# Altium project Nissan-RB25DET-ECU.PrjPcb
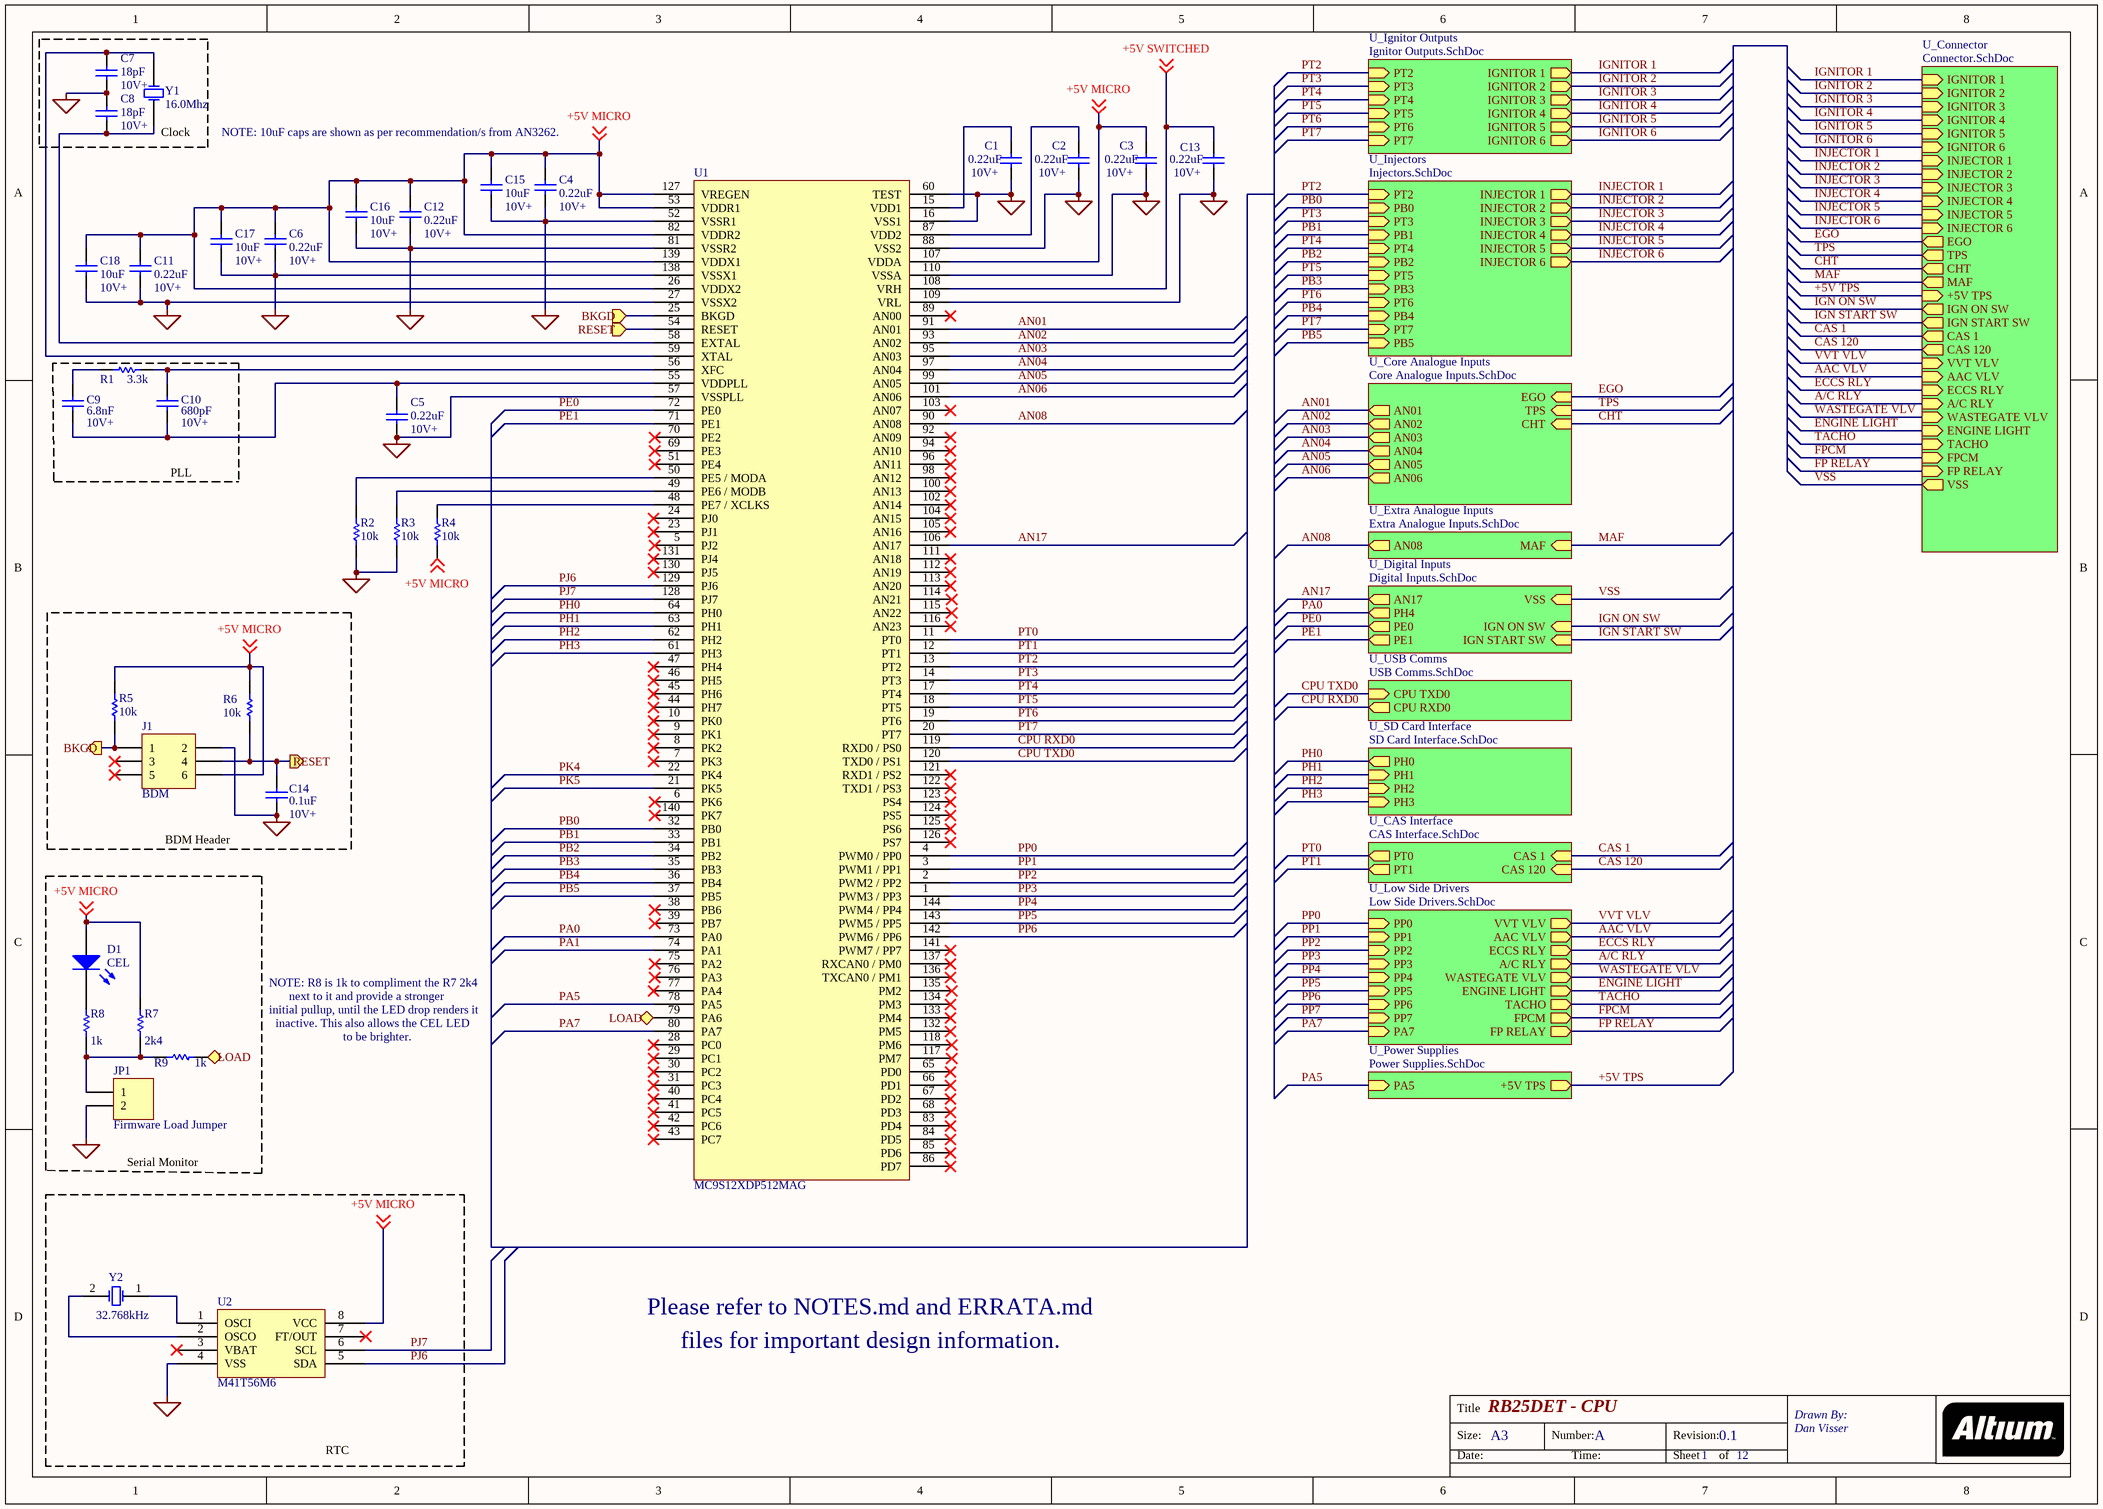
[diagram p0: CPU.SchDoc]
12 sheets, 199 parts. Net scope: hierarchical (ports join the sheet entries above them; power ports are global).
Board file: Nissan-RB25DET-ECU.PcbDoc
Sheets:
  CPU.SchDoc
    U_Ignitor Outputs = Ignitor Outputs.SchDoc
    U_Injectors = Injectors.SchDoc
    U_Digital Inputs = Digital Inputs.SchDoc
    U_USB Comms = USB Comms.SchDoc
    U_Power Supplies = Power Supplies.SchDoc
    U_CAS Interface = CAS Interface.SchDoc
    U_Connector = Connector.SchDoc
    U_Core Analogue Inputs = Core Analogue Inputs.SchDoc
    U_Extra Analogue Inputs = Extra Analogue Inputs.SchDoc
    U_Low Side Drivers = Low Side Drivers.SchDoc
    U_SD Card Interface = SD Card Interface.SchDoc

## Sheet CPU.SchDoc: RB25DET - CPU
size A3; Author: Dan Visser; CompanyName: DIYEFI; DrawnBy: Dan Visser; Engineer: Dan Visser; Address1: Drawn By:; Address2: Dan Visser; DocumentNumber: A; Revision: 0.1; SheetNumber: 1; SheetTotal: 12

### Parts
C1  value 0.22uF  [RAD-0.3]
C2  value 0.22uF  [RAD-0.3]
C3  value 0.22uF  [RAD-0.3]
C4  value 0.22uF  [RAD-0.3]
C5  value 0.22uF  [RAD-0.3]
C6  value 0.22uF  [RAD-0.3]
C7  value 18pF  [RAD-0.3]
C8  value 18pF  [RAD-0.3]
C9  value 6.8nF  [RAD-0.3]
C10  value 680pF  [RAD-0.3]
C11  value 0.22uF  [RAD-0.3]
C12  value 0.22uF  [RAD-0.3]
C13  value 0.22uF  [RAD-0.3]
C14  value 0.1uF  [RAD-0.3]
C15  value 10uF  [RAD-0.3]
C16  value 10uF  [RAD-0.3]
C17  value 10uF  [RAD-0.3]
C18  value 10uF  [RAD-0.3]
D1  CEL  [LED-0]
J1  BDM  [HDR2X3]
JP1  Firmware Load Jumper  [HDR1X2]
R1  value 3.3k  [AXIAL-0.3]
R2  value 10k  [AXIAL-0.3]
R3  value 10k  [AXIAL-0.3]
R4  value 10k  [AXIAL-0.3]
R5  value 10k  [AXIAL-0.3]
R6  value 10k  [AXIAL-0.3]
R7  value 2k4  [AXIAL-0.3]
R8  value 1k  [AXIAL-0.3]
R9  value 1k  [AXIAL-0.3]
U1  MC9S12XDP512MAG
U2  M41T56M6
Y1  16.0Mhz  [R38]
Y2  32.768kHz  [R38]

### Blocks framed on the sheet
Serial Monitor: D1 JP1 R7-R9
RTC: U2 Y2

### Sub-sheets
U_CAS Interface = CAS Interface.SchDoc: PT1 (out), PT0 (out), CAS 120 (in), CAS 1 (in)
U_Connector = Connector.SchDoc: INJECTOR 1 (in), INJECTOR 2 (in), INJECTOR 3 (in), INJECTOR 4 (in), INJECTOR 5 (in), INJECTOR 6 (in), FP RELAY (in), IGNITOR 1 (in), CAS 1 (out), CAS 120 (out), CHT (out), TPS (out), EGO (out), MAF (out), IGNITOR 2 (in), IGNITOR 3 (in), IGNITOR 4 (in), IGNITOR 5 (in), IGNITOR 6 (in), +5V TPS (in), IGN ON SW (out), IGN START SW (out), FPCM (in), TACHO (in), ENGINE LIGHT (in), WASTEGATE VLV (in), A/C RLY (in), ECCS RLY (in), AAC VLV (in), VVT VLV (in), VSS (out)
U_Core Analogue Inputs = Core Analogue Inputs.SchDoc: AN01 (out), AN02 (out), AN03 (out), AN04 (out), EGO (in), TPS (in), CHT (in), AN05 (out), AN06 (out)
U_Digital Inputs = Digital Inputs.SchDoc: PE0 (out), PE1 (out), IGN ON SW (in), IGN START SW (in), PH4 (out), AN17 (out), VSS (in)
U_Extra Analogue Inputs = Extra Analogue Inputs.SchDoc: AN08 (out), MAF (in)
U_Ignitor Outputs = Ignitor Outputs.SchDoc: PT3 (in), PT2 (in), PT4 (in), PT5 (in), PT7 (in), PT6 (in), IGNITOR 1 (out), IGNITOR 2 (out), IGNITOR 3 (out), IGNITOR 4 (out), IGNITOR 5 (out), IGNITOR 6 (out)
U_Injectors = Injectors.SchDoc: PB0 (in), PB1 (in), PB2 (in), PB5 (in), PT7 (in), INJECTOR 3 (out), PB4 (in), PT6 (in), INJECTOR 5 (out), INJECTOR 2 (out), INJECTOR 1 (out), INJECTOR 4 (out), PT5 (in), PB3 (in), PT2 (in), PT3 (in), PT4 (in), INJECTOR 6 (out)
U_Low Side Drivers = Low Side Drivers.SchDoc: PA7 (in), FP RELAY (out), PP4 (in), PP3 (in), PP2 (in), PP1 (in), PP0 (in), VVT VLV (out), AAC VLV (out), ECCS RLY (out), A/C RLY (out), WASTEGATE VLV (out), PP5 (in), PP6 (in), ENGINE LIGHT (out), TACHO (out), FPCM (out), PP7 (in)
U_Power Supplies = Power Supplies.SchDoc: PA5 (in), +5V TPS (out)
U_SD Card Interface = SD Card Interface.SchDoc: PH0 (out), PH1 (in), PH2 (in), PH3 (in)
U_USB Comms = USB Comms.SchDoc: CPU TXD0 (in), CPU RXD0 (out)

### Ports
BKGD (in), BKGD (out), LOAD (bidir), RESET (in), RESET (out)

### Nets
SENSOR GND: C1.1 C2.1 C3.1 C4.1 C5.2 C6.1 C7.1 C8.2 C11.1 C12.1 C13.1 C14.2 C15.1 C16.1 C17.1 C18.1 J1.2 JP1.2 R2.1 R3.1 U1.16(VSS1) U1.27(VSSX2) U1.52(VSSR1) U1.57(VSSPLL) U1.60(TEST) U1.81(VSSR2) U1.88(VSS2) U1.109(VRL) U1.110(VSSA) U1.138(VSSX1) U2.4(VSS)
+5V MICRO: C3.2 C4.2 C6.2 C11.2 C12.2 C15.2 C16.2 C17.2 C18.2 D1.1(A) J1.6 R4.1 R5.2 R6.2 R7.2 U1.26(VDDX2) U1.53(VDDR1) U1.82(VDDR2) U1.107(VDDA) U1.127(VREGEN) U1.139(VDDX1) U2.8(VCC) ; off-sheet +5V MICRO
+5V SWITCHED: C13.2 U1.108(VRH) ; off-sheet +5V SWITCHED
+5V TPS: sheet U_Power Supplies/+5V TPS, sheet U_Connector/+5V TPS
A/C RLY: sheet U_Connector/A/C RLY, sheet U_Low Side Drivers/A/C RLY
AAC VLV: sheet U_Connector/AAC VLV, sheet U_Low Side Drivers/AAC VLV
AN01: U1.91(AN01) ; sheet U_Connector/CHT, sheet U_Core Analogue Inputs/AN01, sheet U_Core Analogue Inputs/CHT  [also labelled CHT]
AN02: U1.93(AN02) ; sheet U_Connector/TPS, sheet U_Core Analogue Inputs/AN02, sheet U_Core Analogue Inputs/TPS  [also labelled TPS]
AN03: U1.95(AN03) ; sheet U_Connector/EGO, sheet U_Core Analogue Inputs/AN03, sheet U_Core Analogue Inputs/EGO  [also labelled EGO]
AN04: U1.97(AN04) ; sheet U_Core Analogue Inputs/AN04
AN05: U1.99(AN05) ; sheet U_Core Analogue Inputs/AN05
AN06: U1.101(AN06) ; sheet U_Core Analogue Inputs/AN06
AN08: U1.90(AN08) ; sheet U_Connector/MAF, sheet U_Extra Analogue Inputs/AN08, sheet U_Extra Analogue Inputs/MAF  [also labelled MAF]
AN17: U1.106(AN17) ; sheet U_Digital Inputs/AN17
CAS 1: sheet U_CAS Interface/CAS 1, sheet U_Connector/CAS 1
CAS 120: sheet U_CAS Interface/CAS 120, sheet U_Connector/CAS 120
CPU RXD0: U1.119(RXD0_/_PS0) ; sheet U_USB Comms/CPU RXD0
CPU TXD0: U1.120(TXD0_/_PS1) ; sheet U_USB Comms/CPU TXD0
ECCS RLY: sheet U_Connector/ECCS RLY, sheet U_Low Side Drivers/ECCS RLY
ENGINE LIGHT: sheet U_Connector/ENGINE LIGHT, sheet U_Low Side Drivers/ENGINE LIGHT
FP RELAY: sheet U_Connector/FP RELAY, sheet U_Low Side Drivers/FP RELAY
FPCM: sheet U_Connector/FPCM, sheet U_Low Side Drivers/FPCM
IGN ON SW: sheet U_Digital Inputs/IGN ON SW, sheet U_Connector/IGN ON SW
IGN START SW: sheet U_Digital Inputs/IGN START SW, sheet U_Connector/IGN START SW
IGNITOR 1: sheet U_Ignitor Outputs/IGNITOR 1, sheet U_Connector/IGNITOR 1
IGNITOR 2: sheet U_Ignitor Outputs/IGNITOR 2, sheet U_Connector/IGNITOR 2
IGNITOR 3: sheet U_Ignitor Outputs/IGNITOR 3, sheet U_Connector/IGNITOR 3
IGNITOR 4: sheet U_Ignitor Outputs/IGNITOR 4, sheet U_Connector/IGNITOR 4
IGNITOR 5: sheet U_Ignitor Outputs/IGNITOR 5, sheet U_Connector/IGNITOR 5
IGNITOR 6: sheet U_Ignitor Outputs/IGNITOR 6, sheet U_Connector/IGNITOR 6
INJECTOR 1: sheet U_Injectors/INJECTOR 1, sheet U_Connector/INJECTOR 1
INJECTOR 2: sheet U_Injectors/INJECTOR 2, sheet U_Connector/INJECTOR 2
INJECTOR 3: sheet U_Injectors/INJECTOR 3, sheet U_Connector/INJECTOR 3
INJECTOR 4: sheet U_Injectors/INJECTOR 4, sheet U_Connector/INJECTOR 4
INJECTOR 5: sheet U_Injectors/INJECTOR 5, sheet U_Connector/INJECTOR 5
INJECTOR 6: sheet U_Injectors/INJECTOR 6, sheet U_Connector/INJECTOR 6
PA0: U1.73(PA0) ; sheet U_Digital Inputs/PH4
PA1: U1.74(PA1)
PA5: U1.78(PA5) ; sheet U_Power Supplies/PA5
PA7: U1.80(PA7) ; sheet U_Low Side Drivers/PA7
PB0: U1.32(PB0) ; sheet U_Injectors/PB0
PB1: U1.33(PB1) ; sheet U_Injectors/PB1
PB2: U1.34(PB2) ; sheet U_Injectors/PB2
PB3: U1.35(PB3) ; sheet U_Injectors/PB3
PB4: U1.36(PB4) ; sheet U_Injectors/PB4
PB5: U1.37(PB5) ; sheet U_Injectors/PB5
PE0: U1.72(PE0) ; sheet U_Digital Inputs/PE0
PE1: U1.71(PE1) ; sheet U_Digital Inputs/PE1
PH0: U1.64(PH0) ; sheet U_SD Card Interface/PH0
PH1: U1.63(PH1) ; sheet U_SD Card Interface/PH1
PH2: U1.62(PH2) ; sheet U_SD Card Interface/PH2
PH3: U1.61(PH3) ; sheet U_SD Card Interface/PH3
PJ6: U1.129(PJ6) U2.5(SDA)
PJ7: U1.128(PJ7) U2.6(SCL)
PK4: U1.22(PK4)
PK5: U1.21(PK5)
PP0: U1.4(PWM0_/_PP0) ; sheet U_Low Side Drivers/PP0
PP1: U1.3(PWM1_/_PP1) ; sheet U_Low Side Drivers/PP1
PP2: U1.2(PWM2_/_PP2) ; sheet U_Low Side Drivers/PP2
PP3: U1.1(PWM3_/_PP3) ; sheet U_Low Side Drivers/PP3
PP4: U1.144(PWM4_/_PP4) ; sheet U_Low Side Drivers/PP4
PP5: U1.143(PWM5_/_PP5) ; sheet U_Low Side Drivers/PP5
PP6: U1.142(PWM6_/_PP6) ; sheet U_Low Side Drivers/PP6
PT0: U1.11(PT0) ; sheet U_CAS Interface/PT0
PT1: U1.12(PT1) ; sheet U_CAS Interface/PT1
PT2: U1.13(PT2) ; sheet U_Ignitor Outputs/PT2, sheet U_Injectors/PT2
PT3: U1.14(PT3) ; sheet U_Ignitor Outputs/PT3, sheet U_Injectors/PT3
PT4: U1.17(PT4) ; sheet U_Ignitor Outputs/PT4, sheet U_Injectors/PT4
PT5: U1.18(PT5) ; sheet U_Ignitor Outputs/PT5, sheet U_Injectors/PT5
PT6: U1.19(PT6) ; sheet U_Ignitor Outputs/PT6, sheet U_Injectors/PT6
PT7: U1.20(PT7) ; sheet U_Ignitor Outputs/PT7, sheet U_Injectors/PT7
TACHO: sheet U_Connector/TACHO, sheet U_Low Side Drivers/TACHO
VSS: sheet U_Digital Inputs/VSS, sheet U_Connector/VSS
VVT VLV: sheet U_Connector/VVT VLV, sheet U_Low Side Drivers/VVT VLV
WASTEGATE VLV: sheet U_Connector/WASTEGATE VLV, sheet U_Low Side Drivers/WASTEGATE VLV
NetC1_2: C1.2 U1.15(VDD1)
NetC2_2: C2.2 U1.87(VDD2)
NetC5_1: C5.1 C9.1 C10.1 U1.55(VDDPLL)
NetC7_2: C7.2 U1.59(XTAL) Y1.2(OSC2)
NetC8_1: C8.1 U1.58(EXTAL) Y1.1(OSC1)
NetC9_2: C9.2 R1.1
NetC10_2: C10.2 R1.2 U1.56(XFC)
NetC14_1: C14.1 J1.4 R6.1 U1.54(RESET) ; port RESET
NetD1_2: D1.2(K) R8.2
NetJ1_1: J1.1 R5.1 U1.25(BKGD) ; port BKGD
NetJP1_1: JP1.1 R7.1 R8.1 R9.1
NetR2_2: R2.2 U1.50(PE5_/_MODA)
NetR3_2: R3.2 U1.49(PE6_/_MODB)
NetR4_2: R4.2 U1.48(PE7_/_XCLKS)
NetR9_2: R9.2 U1.79(PA6) ; port LOAD
NetU2_1: U2.1(OSCI) Y2.1(OSC1)
NetU2_2: U2.2(OSCO) Y2.2(OSC2)

Not connected (* = marked no-connect by the designer): J1 3* 5*; U1 5(PJ2) 6(PK6) 7(PK3)* 8(PK2)* 9(PK1)* 10(PK0)* 23(PJ1)* 24(PJ0)* 28(PC0)* 29(PC1)* 30(PC2)* 31(PC3)* 38(PB6) 39(PB7) 40(PC4)* 41(PC5)* 42(PC6)* 43(PC7)* 44(PH7)* 45(PH6)* 46(PH5)* 47(PH4)* 51(PE4) 65(PD0)* 66(PD1)* 67(PD2)* 68(PD3)* 69(PE3) 70(PE2) 75(PA2) 76(PA3) 77(PA4)* 83(PD4)* 84(PD5)* 85(PD6)* 86(PD7)* 89(AN00)* 92(AN09)* 94(AN10)* 96(AN11)* 98(AN12)* 100(AN13)* 102(AN14)* 103(AN07)* 104(AN15)* 105(AN16)* 111(AN18)* 112(AN19)* 113(AN20)* 114(AN21) 115(AN22) 116(AN23)* 117(PM7) 118(PM6) 121(RXD1_/_PS2)* 122(TXD1_/_PS3)* 123(PS4)* 124(PS5)* 125(PS6)* 126(PS7)* 130(PJ5)* 131(PJ4)* 132(PM5)* 133(PM4)* 134(PM3)* 135(PM2) 136(TXCAN0_/_PM1)* 137(RXCAN0_/_PM0)* 140(PK7) 141(PWM7_/_PP7)*; U2 3(VBAT)* 7(FT/OUT)*

### Notes on the sheet
- 10V+
- (near Y1) Clock
- NOTE: 10uF caps are shown as per recommendation/s from AN3262.
- (near C1) 10V+
- (near C12) 10V+
- (near C4) 10V+
- (near C11) 10V+
- (near C6) 10V+
- (near C9) 10V+
- (near C10) 10V+
- (near C5) 10V+
- PLL
- BDM Header
- (near C14) 10V+
- NOTE: R8 is 1k to compliment the R7 2k4
- initial pullup, until the LED drop renders it
- inactive. This also allows the CEL LED
- next to it and provide a stronger
- to be brighter.
- Please refer to NOTES.md and ERRATA.md
- files for important design information.
- Title
- Size:
- Date:
- A3
- Number:
- Time:
- Revision:
- Sheet
- of

### Library data of the parts
C1-C18 = Cap: Capacitor; Published: 8-Jun-2000; LatestRevisionDate: 17-Jul-2002; LatestRevisionNote: Re-released for DXP Platform.; PackageReference: RAD-0.3; Publisher: Altium Limited; PackageDescription: Radial Cap, Thru-Hole; 2 Leads; 0.3 in Pin Spacing
D1 = LED0: 0805 Package; Published: 8-Jun-2000; LatestRevisionDate: 08-Jul-2005; LatestRevisionNote: Mech Layer 1 removed.; PackageReference: LED-0; Publisher: Altium Limited; PackageDescription: LED; 2 Leads
J1 = Header 3X2: Header, 3-Pin, Dual row; LatestRevisionDate: 17-Jul-2002; LatestRevisionNote: Re-released for DXP Platform.; Publisher: Altium Limited
JP1 = Header 2: Header, 2-Pin; LatestRevisionDate: 17-Jul-2002; LatestRevisionNote: Re-released for DXP Platform.; Publisher: Altium Limited
R1-R9 = Res1: Resistor; Published: 8-Jun-2000; LatestRevisionDate: 17-Jul-2002; LatestRevisionNote: Re-released for DXP Platform.; PackageReference: AXIAL-0.3; Publisher: Altium Limited; PackageDescription: Axial Device, Thru-Hole; 2 Leads; 0.3 in Pin Spacing
U1 = MC9S12XDP512VAG
U2 = M41T56M6E
Y1 Y2 = XTAL: Crystal Oscillator; Published: 8-Jun-2000; LatestRevisionDate: 17-Jul-2002; LatestRevisionNote: Re-released for DXP Platform.; PackageReference: R38; Publisher: Altium Limited; PackageDescription: Crystal, Thru-Hole; 2 Leads; Body 3.1 x 8.2 mm (Dia.xH)

## Sheet Ignitor Outputs.SchDoc: RB25DET - Ignitor Outputs
size A4; Address1: Drawn By:; Address2: Dan Visser; DocumentNumber: A; Revision: 0.1; SheetNumber: 8; SheetTotal: 12
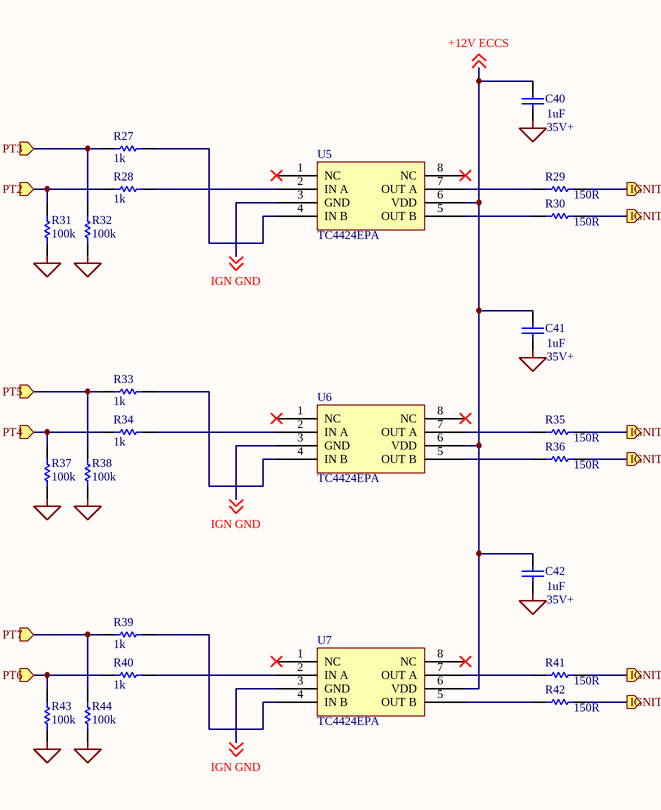
[diagram p1: Ignitor Outputs.SchDoc]

### Parts
C40  value 1uF  [RAD-0.3]
C41  value 1uF  [RAD-0.3]
C42  value 1uF  [RAD-0.3]
R27  value 1k  [AXIAL-0.3]
R28  value 1k  [AXIAL-0.3]
R29  value 150R  [AXIAL-0.3]
R30  value 150R  [AXIAL-0.3]
R31  value 100k  [AXIAL-0.3]
R32  value 100k  [AXIAL-0.3]
R33  value 1k  [AXIAL-0.3]
R34  value 1k  [AXIAL-0.3]
R35  value 150R  [AXIAL-0.3]
R36  value 150R  [AXIAL-0.3]
R37  value 100k  [AXIAL-0.3]
R38  value 100k  [AXIAL-0.3]
R39  value 1k  [AXIAL-0.3]
R40  value 1k  [AXIAL-0.3]
R41  value 150R  [AXIAL-0.3]
R42  value 150R  [AXIAL-0.3]
R43  value 100k  [AXIAL-0.3]
R44  value 100k  [AXIAL-0.3]
U5  TC4424EPA
U6  TC4424EPA
U7  TC4424EPA

### Ports
IGNITOR 1 (out), IGNITOR 2 (out), IGNITOR 3 (out), IGNITOR 4 (out), IGNITOR 5 (out), IGNITOR 6 (out), PT2 (in), PT3 (in), PT4 (in), PT5 (in), PT6 (in), PT7 (in)

### Nets
SENSOR GND: C40.1 C41.1 C42.1 R31.1 R32.1 R37.1 R38.1 R43.1 R44.1
+12V ECCS: C40.2 C41.2 C42.2 U5.6(VDD) U6.6(VDD) U7.6(VDD) ; off-sheet +12V ECCS
IGN GND: U5.3(GND) U6.3(GND) U7.3(GND) ; off-sheet IGN GND
IGNITOR 1: R29.2 ; port IGNITOR 1
IGNITOR 2: R30.2 ; port IGNITOR 2
IGNITOR 3: R35.2 ; port IGNITOR 3
IGNITOR 4: R36.2 ; port IGNITOR 4
IGNITOR 5: R41.2 ; port IGNITOR 5
IGNITOR 6: R42.2 ; port IGNITOR 6
PT2: R28.2 R31.2 ; port PT2
PT3: R27.2 R32.2 ; port PT3
PT4: R34.2 R37.2 ; port PT4
PT5: R33.2 R38.2 ; port PT5
PT6: R40.2 R43.2 ; port PT6
PT7: R39.2 R44.2 ; port PT7
NetR27_1: R27.1 U5.4(IN_B)
NetR28_1: R28.1 U5.2(IN_A)
NetR29_1: R29.1 U5.7(OUT_A)
NetR30_1: R30.1 U5.5(OUT_B)
NetR33_1: R33.1 U6.4(IN_B)
NetR34_1: R34.1 U6.2(IN_A)
NetR35_1: R35.1 U6.7(OUT_A)
NetR36_1: R36.1 U6.5(OUT_B)
NetR39_1: R39.1 U7.4(IN_B)
NetR40_1: R40.1 U7.2(IN_A)
NetR41_1: R41.1 U7.7(OUT_A)
NetR42_1: R42.1 U7.5(OUT_B)

Not connected (* = marked no-connect by the designer): U5 1(NC)* 8(NC)*; U6 1(NC)* 8(NC)*; U7 1(NC)* 8(NC)*

### Notes on the sheet
- (near C40) 35V+
- (near C41) 35V+
- (near C42) 35V+
- Title
- Size:
- Date:
- A4
- Number:
- Time:
- Revision:
- Sheet
- of

### Library data of the parts
C40-C42 = Cap: Capacitor; Published: 8-Jun-2000; LatestRevisionDate: 17-Jul-2002; LatestRevisionNote: Re-released for DXP Platform.; PackageReference: RAD-0.3; Publisher: Altium Limited; PackageDescription: Radial Cap, Thru-Hole; 2 Leads; 0.3 in Pin Spacing
R27-R44 = Res1: Resistor; Published: 8-Jun-2000; LatestRevisionDate: 17-Jul-2002; LatestRevisionNote: Re-released for DXP Platform.; PackageReference: AXIAL-0.3; Publisher: Altium Limited; PackageDescription: Axial Device, Thru-Hole; 2 Leads; 0.3 in Pin Spacing
U5-U7 = TC427COA

## Sheet Injectors.SchDoc: RB25DET - Injectors
size A4; Address1: Drawn By:; Address2: Dan Visser; DocumentNumber: A; Revision: 0.1; SheetNumber: 9; SheetTotal: 12
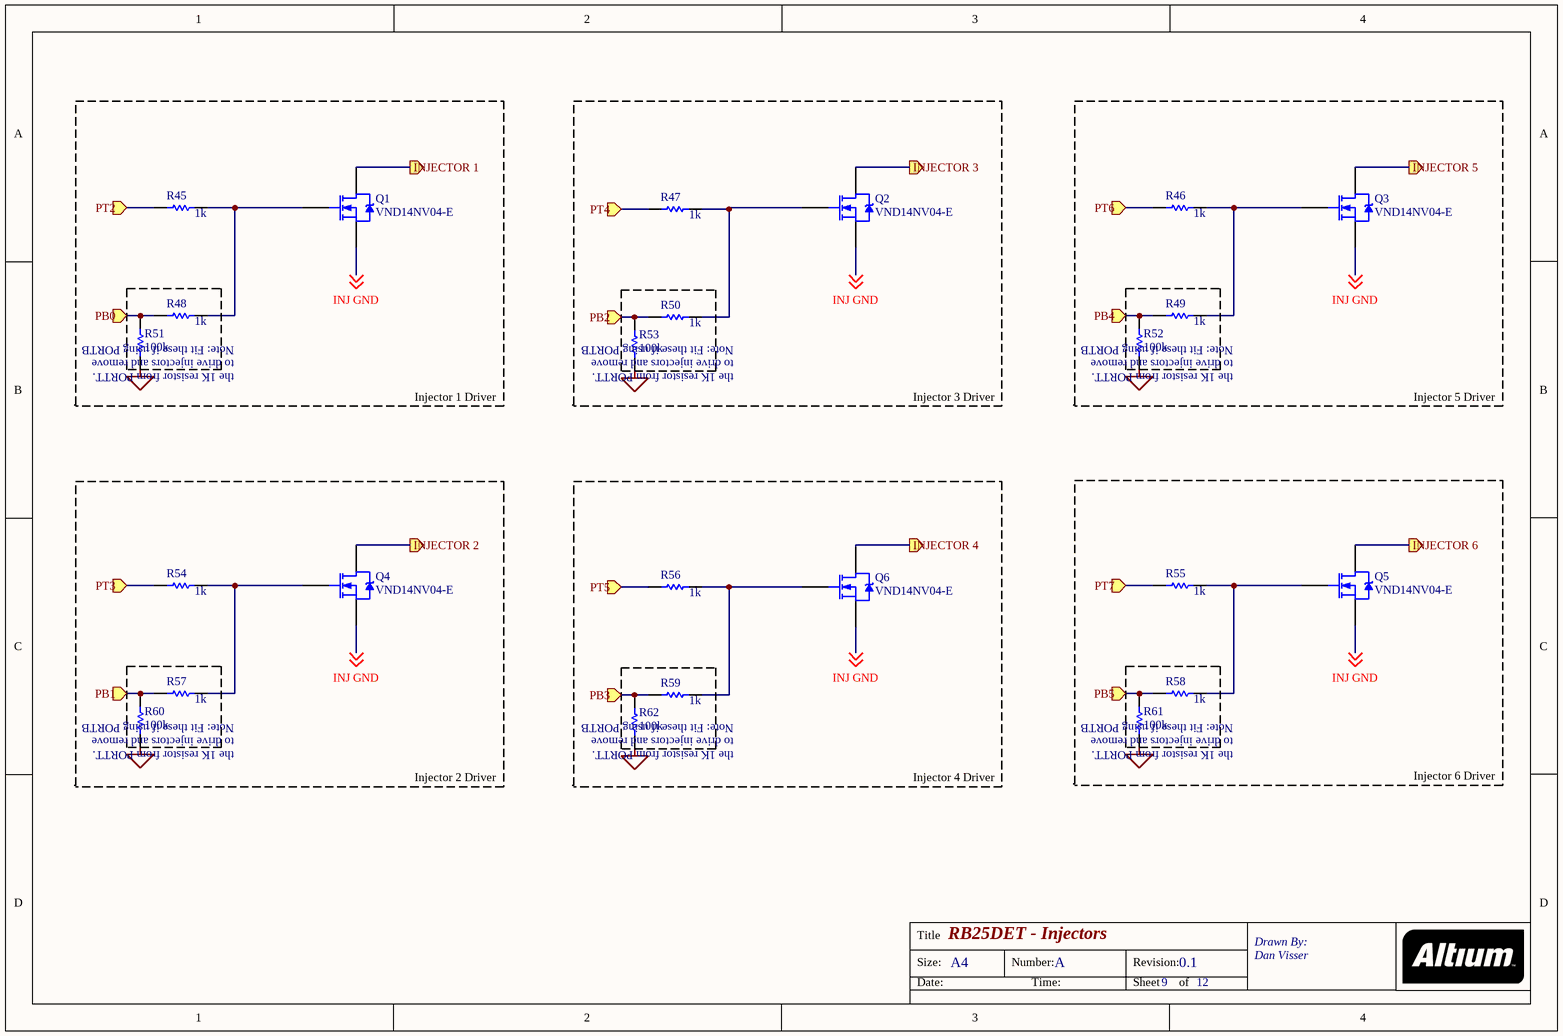
[diagram p2: Injectors.SchDoc]

### Parts
Q1  VND14NV04-E  [TO-220AB]
Q2  VND14NV04-E  [TO-220AB]
Q3  VND14NV04-E  [TO-220AB]
Q4  VND14NV04-E  [TO-220AB]
Q5  VND14NV04-E  [TO-220AB]
Q6  VND14NV04-E  [TO-220AB]
R45  value 1k  [AXIAL-0.3]
R46  value 1k  [AXIAL-0.3]
R47  value 1k  [AXIAL-0.3]
R48  value 1k  [AXIAL-0.3]
R49  value 1k  [AXIAL-0.3]
R50  value 1k  [AXIAL-0.3]
R51  value 100k  [AXIAL-0.3]
R52  value 100k  [AXIAL-0.3]
R53  value 100k  [AXIAL-0.3]
R54  value 1k  [AXIAL-0.3]
R55  value 1k  [AXIAL-0.3]
R56  value 1k  [AXIAL-0.3]
R57  value 1k  [AXIAL-0.3]
R58  value 1k  [AXIAL-0.3]
R59  value 1k  [AXIAL-0.3]
R60  value 100k  [AXIAL-0.3]
R61  value 100k  [AXIAL-0.3]
R62  value 100k  [AXIAL-0.3]

### Ports
INJECTOR 1 (out), INJECTOR 2 (out), INJECTOR 3 (out), INJECTOR 4 (out), INJECTOR 5 (out), INJECTOR 6 (out), PB0 (in), PB1 (in), PB2 (in), PB3 (in), PB4 (in), PB5 (in), PT2 (in), PT3 (in), PT4 (in), PT5 (in), PT6 (in), PT7 (in)

### Nets
SENSOR GND: R51.1 R52.1 R53.1 R60.1 R61.1 R62.1
INJ GND: Q1.3(S) Q2.3(S) Q3.3(S) Q4.3(S) Q5.3(S) Q6.3(S) ; off-sheet INJ GND
INJECTOR 1: Q1.2(D) ; port INJECTOR 1
INJECTOR 2: Q4.2(D) ; port INJECTOR 2
INJECTOR 3: Q2.2(D) ; port INJECTOR 3
INJECTOR 4: Q6.2(D) ; port INJECTOR 4
INJECTOR 5: Q3.2(D) ; port INJECTOR 5
INJECTOR 6: Q5.2(D) ; port INJECTOR 6
PB0: R48.1 R51.2 ; port PB0
PB1: R57.1 R60.2 ; port PB1
PB2: R50.1 R53.2 ; port PB2
PB3: R59.1 R62.2 ; port PB3
PB4: R49.1 R52.2 ; port PB4
PB5: R58.1 R61.2 ; port PB5
PT2: R45.1 ; port PT2
PT3: R54.1 ; port PT3
PT4: R47.1 ; port PT4
PT5: R56.1 ; port PT5
PT6: R46.1 ; port PT6
PT7: R55.1 ; port PT7
NetQ1_1: Q1.1(G) R45.2 R48.2
NetQ2_1: Q2.1(G) R47.2 R50.2
NetQ3_1: Q3.1(G) R46.2 R49.2
NetQ4_1: Q4.1(G) R54.2 R57.2
NetQ5_1: Q5.1(G) R55.2 R58.2
NetQ6_1: Q6.1(G) R56.2 R59.2

### Notes on the sheet
- (near R48) Note: Fit these if using PORTB
- to drive injectors and remove
- the 1K resistor from PORTT.
- (near R50) Note: Fit these if using PORTB
- (near R49) Note: Fit these if using PORTB
- Injector 1 Driver
- Injector 3 Driver
- Injector 5 Driver
- (near R57) Note: Fit these if using PORTB
- (near R59) Note: Fit these if using PORTB
- (near R58) Note: Fit these if using PORTB
- Injector 2 Driver
- Injector 4 Driver
- Injector 6 Driver
- Title
- Size:
- Date:
- A4
- Number:
- Time:
- Revision:
- Sheet
- of

### Library data of the parts
Q1-Q6 = IRL520N: HEXFET Power MOSFET; Note: Pin 2 is electrically connected to pin 4 (Drain).; Published: 8-Jun-2000; LatestRevisionDate: 17-Jul-2002; LatestRevisionNote: Re-released for DXP Platform.; DatasheetVersion: May-1998; PackageVersion: Feb-1997; PackageReference: TO-220AB; Publisher: Altium Limited; PackageDescription: TO, Thru-Hole, Vertical, Heatsink Mounted; 3 In-Line Leads; Pitch 2.54 mm; ComponentLink1Description: Manufacturer Link; ComponentLink1URL: http://www.irf.com/; ComponentLink2Description: Datasheet; ComponentLink2URL: http://www.irf.com/product-info/datasheets/data/irl520n.pdf
R45-R62 = Res1: Resistor; Published: 8-Jun-2000; LatestRevisionDate: 17-Jul-2002; LatestRevisionNote: Re-released for DXP Platform.; PackageReference: AXIAL-0.3; Publisher: Altium Limited; PackageDescription: Axial Device, Thru-Hole; 2 Leads; 0.3 in Pin Spacing

## Sheet Digital Inputs.SchDoc: RB25DET - Digital Inputs
size A4; Address1: Drawn By:; Address2: Dan Visser; DocumentNumber: A; Revision: 0.1; SheetNumber: 6; SheetTotal: 12
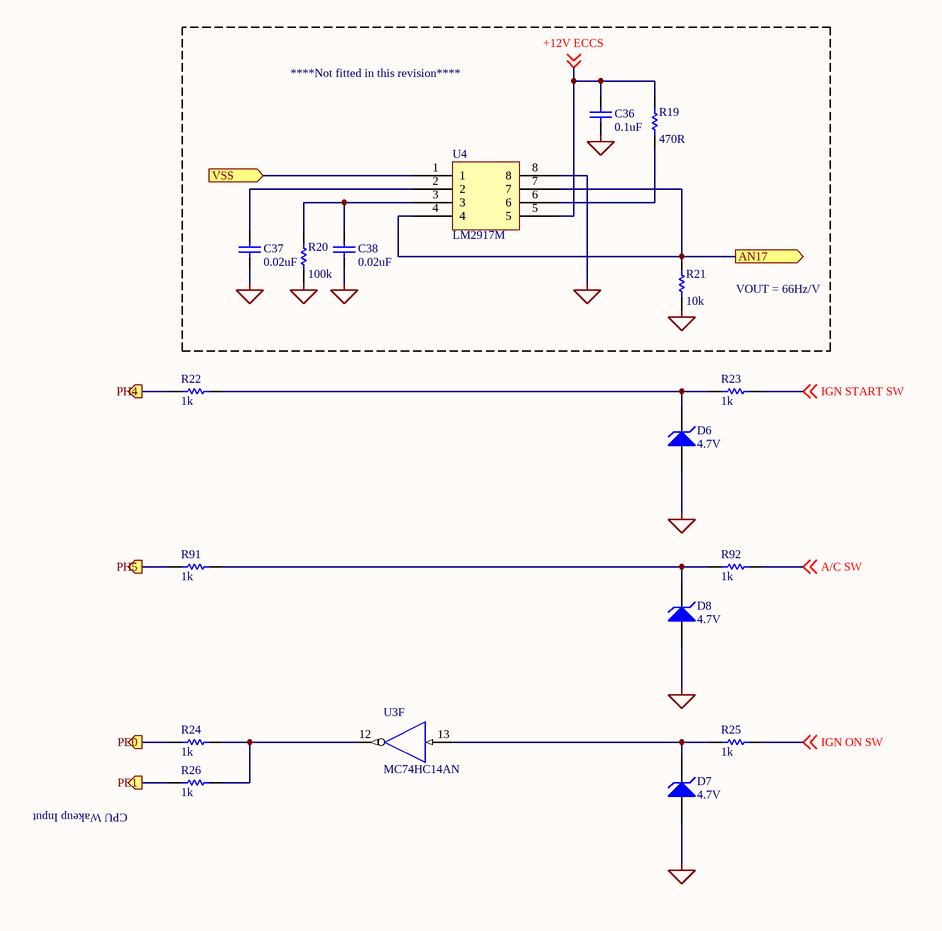
[diagram p3: Digital Inputs.SchDoc]

### Parts
C36  value 0.1uF  [RAD-0.3]
C37  value 0.02uF  [RAD-0.3]
C38  value 0.02uF  [RAD-0.3]
D6  4.7V  [DIODE-0.7]
D7  4.7V  [DIODE-0.7]
D8  4.7V  [DIODE-0.7]
R19  value 470R  [AXIAL-0.3]
R20  value 100k  [AXIAL-0.3]
R21  value 10k  [AXIAL-0.3]
R22  value 1k  [AXIAL-0.3]
R23  value 1k  [AXIAL-0.3]
R24  value 1k  [AXIAL-0.3]
R25  value 1k  [AXIAL-0.3]
R26  value 1k  [AXIAL-0.3]
R91  value 1k  [AXIAL-0.3]
R92  value 1k  [AXIAL-0.3]
U3  MC74HC14AN  [646-06]  (part F of 6)
U4  LM2917M  [SOIC8N_N]

### Ports
AN17 (out), PE0 (out), PE1 (out), PH4 (out), PH5 (out), VSS (in)

### Nets
GND: U3.7(GND)
SENSOR GND: C36.1 C37.1 C38.1 D6.1(A) D7.1(A) D8.1(A) R20.1 R21.1 U4.8
VDD: U3.14(VDD)
+12V ECCS: C36.2 R19.2 U4.5 ; off-sheet +12V ECCS
A/C SW: R92.2 ; off-sheet A/C SW
AN17: R21.2 U4.4 U4.7 ; port AN17
IGN ON SW: R25.2 ; off-sheet IGN ON SW
IGN START SW: R23.2 ; off-sheet IGN START SW
PA0: R22.2 ; port PH4
PE0: R24.2 ; port PE0
PE1: R26.2 ; port PE1
VSS: U4.1 ; port VSS
NetC37_2: C37.2 U4.2
NetC38_2: C38.2 R20.2 U4.3
NetD6_2: D6.2(K) R22.1 R23.1
NetD7_2: D7.2(K) R25.1 U3.13(A)
NetD8_2: D8.2(K) R91.1 R92.1
NetR19_1: R19.1 U4.6
NetR24_1: R24.1 R26.1 U3.12(Y)
NetR91_2: R91.2 ; port PH5

### Notes on the sheet
- ****Not fitted in this revision****
- VOUT = 66Hz/V
- (near R26) CPU Wakeup Input
- Title
- Size:
- Date:
- A4
- Number:
- Time:
- Revision:
- Sheet
- of

### Library data of the parts
C36-C38 = Cap: Capacitor; Published: 8-Jun-2000; LatestRevisionDate: 17-Jul-2002; LatestRevisionNote: Re-released for DXP Platform.; PackageReference: RAD-0.3; Publisher: Altium Limited; PackageDescription: Radial Cap, Thru-Hole; 2 Leads; 0.3 in Pin Spacing
D6-D8 = D Zener: Zener Diode; Published: 8-Jun-2000; LatestRevisionDate: 17-Jul-2002; LatestRevisionNote: Re-released for DXP Platform.; PackageReference: DIODE-0.7; Publisher: Altium Limited; PackageDescription: Diode, Thru-Hole; 2 Leads; 0.7 in Pin Spacing
R19-R21 = res1: Resistor; Published: 8-Jun-2000; LatestRevisionDate: 17-Jul-2002; LatestRevisionNote: Re-released for DXP Platform.; PackageReference: AXIAL-0.3; Publisher: Altium Limited; PackageDescription: Axial Device, Thru-Hole; 2 Leads; 0.3 in Pin Spacing
R22-R26 R91 R92 = Res1: Resistor; Published: 8-Jun-2000; LatestRevisionDate: 17-Jul-2002; LatestRevisionNote: Re-released for DXP Platform.; PackageReference: AXIAL-0.3; Publisher: Altium Limited; PackageDescription: Axial Device, Thru-Hole; 2 Leads; 0.3 in Pin Spacing
U3 = MC74HC14AN: Hex Schmitt Trigger Inverter; Published: 17-Jul-2002; LatestRevisionDate: 06-Jun-2005; LatestRevisionNote: Stylized 3D Model Added; DatasheetVersion: 1989; PackageVersion: 1997; PackageReference: 646-06; Publisher: Altium Limited; PackageDescription: DIP; 14 Leads; Row Spacing 7.62 mm; Pitch 2.54 mm; ComponentLink1Description: Manufacturer Link; ComponentLink1URL: http://www.onsemi.com/site/products/parametrics/0,4446,247,00.html; ComponentLink2Description: Ibis Model; ComponentLink2URL: http://www.onsemi.com/pub/Collateral/MC54HC14AJ.IBS

## Sheet USB Comms.SchDoc: RB25DET - USB Comms
size A4; Address1: Drawn By:; Address2: Dan Visser; DocumentNumber: A; Revision: 0.1; SheetNumber: 3; SheetTotal: 12
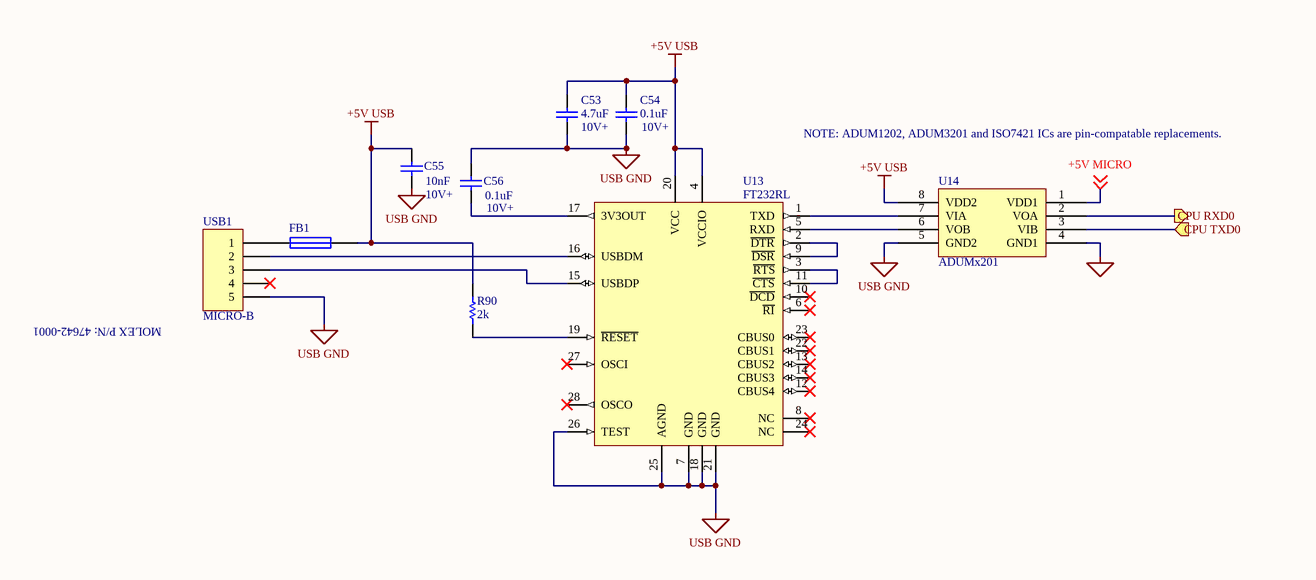
[diagram p4: USB Comms.SchDoc]

### Parts
C53  value 4.7uF  [RAD-0.3]
C54  value 0.1uF  [RAD-0.3]
C55  value 10nF  [RAD-0.3]
C56  value 0.1uF  [RAD-0.3]
FB1  (no value)  [PIN-W2/E2.8]
R90  value 2k  [AXIAL-0.3]
U13  FT232RL  [SSOP-28_M]
U14  ADUMx201
USB1  MICRO-B  [HDR1X5]

### Ports
CPU RXD0 (out), CPU TXD0 (in)

### Nets
+5V USB: C53.2 C54.2 C55.2 FB1.2 R90.2 U13.4(VCCIO) U13.20(VCC) U14.8(VDD2)
SENSOR GND: U14.4(GND1)
USB GND: C53.1 C54.1 C55.1 C56.2 U13.7(GND) U13.18(GND) U13.21(GND) U13.25(AGND) U13.26(TEST) U14.5(GND2) USB1.5
+5V MICRO: U14.1(VDD1) ; off-sheet +5V MICRO
CPU RXD0: U14.2(VOA) ; port CPU RXD0
CPU TXD0: U14.3(VIB) ; port CPU TXD0
NetC56_1: C56.1 U13.17(3V3OUT)
NetR90_1: R90.1 U13.19(~{RESET})
NetU13_1: U13.1(TXD) U14.7(VIA)
NetU13_2: U13.2(~{DTR}) U13.9(~{DSR})
NetU13_3: U13.3(~{RTS}) U13.11(~{CTS})
NetU13_5: U13.5(RXD) U14.6(VOB)
NetU13_15: U13.15(USBDP) USB1.3
NetU13_16: U13.16(USBDM) USB1.2

Not connected (* = marked no-connect by the designer): FB1 1; U13 6(~{RI})* 8(NC)* 10(~{DCD})* 12(CBUS4)* 13(CBUS2)* 14(CBUS3)* 22(CBUS1)* 23(CBUS0)* 24(NC)* 27(OSCI)* 28(OSCO)*; USB1 1 4*

### Notes on the sheet
- 10V+
- (near C54) 10V+
- NOTE: ADUM1202, ADUM3201 and ISO7421 ICs are pin-compatable replacements.
- (near C56) 10V+
- (near USB1) MOLEX P/N: 47642-0001
- Title
- Size:
- Date:
- A4
- Number:
- Time:
- Revision:
- Sheet
- of

### Library data of the parts
C53-C56 = Cap: Capacitor; Published: 8-Jun-2000; LatestRevisionDate: 17-Jul-2002; LatestRevisionNote: Re-released for DXP Platform.; PackageReference: RAD-0.3; Publisher: Altium Limited; PackageDescription: Radial Cap, Thru-Hole; 2 Leads; 0.3 in Pin Spacing
FB1 = Fuse 1: Published: 8-Jun-2000; LatestRevisionDate: 17-Jul-2002; LatestRevisionNote: Re-released for DXP Platform.; PackageReference: PIN-W2/E2.8; Publisher: Altium Limited; PackageDescription: Thru-Hole; 2 Leads
R90 = Res1: Resistor; Published: 8-Jun-2000; LatestRevisionDate: 17-Jul-2002; LatestRevisionNote: Re-released for DXP Platform.; PackageReference: AXIAL-0.3; Publisher: Altium Limited; PackageDescription: Axial Device, Thru-Hole; 2 Leads; 0.3 in Pin Spacing
U13 = FT232RL-Tray: USB UART Asynchronous Serial Data Transfer Chip, SSOP-28, Tray; Published: 19-Aug-2010; DatasheetVersion: ver 2.07, Jul-2010; PackageVersion: 2010; PackageReference: SSOP-28; Publisher: Altium Limited; PackageDescription: 28-Pin Small Outline Package 0.65 mm Pitch; ComponentLink1Description: Manufacturer Link; ComponentLink1URL: http://www.ftdichip.com/Products/ICs/FT232R.htm; ComponentLink2Description: Datasheet; ComponentLink2URL: http://www.ftdichip.com/Support/Documents/DataSheets/ICs/DS_FT232R.pdf
U14 = ADUM3201
USB1 = Header 5: Header, 5-Pin; LatestRevisionDate: 17-Jul-2002; LatestRevisionNote: Re-released for DXP Platform.; Publisher: Altium Limited

## Sheet Power Supplies.SchDoc: RB25DET - Power Supplies
size A4; Address1: Drawn By:; Address2: Dan Visser; DocumentNumber: A; Revision: 0.1; SheetNumber: 2; SheetTotal: 12; PageSetup: Record=PageOptions|CenterHorizontal=True|CenterVertical=True|PrintScale=0.97|XCorrection=1.00|YCorrection=1.00|PrintKind=1|BorderSize=5000000|LeftOffset=0|BottomOffset=0|Orientation=2|PaperLength=1000|PaperWidth=1000|Scale=100|PaperSource=1274|PrintQuality=600|MediaType=1|DitherType=10|PaperKind=A4|PrintScaleMode=1
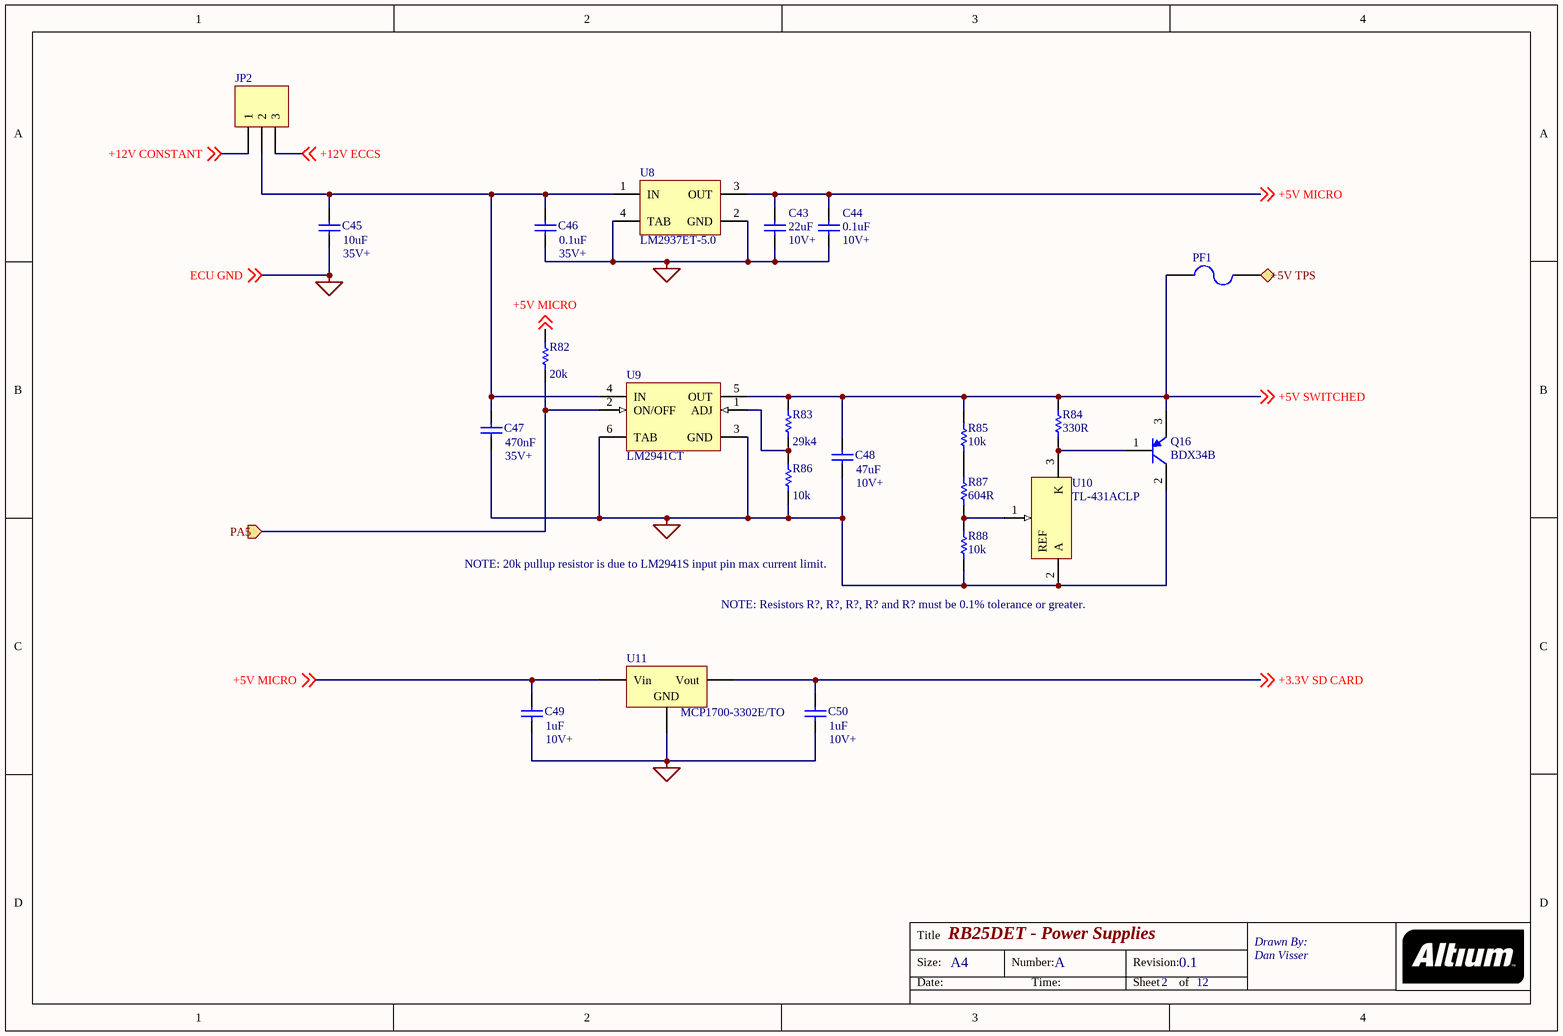
[diagram p5: Power Supplies.SchDoc]

### Parts
C43  value 22uF  [RAD-0.3]
C44  value 0.1uF  [RAD-0.3]
C45  value 10uF  [RAD-0.3]
C46  value 0.1uF  [RAD-0.3]
C47  value 470nF  [RAD-0.3]
C48  value 47uF  [RAD-0.3]
C49  value 1uF  [RAD-0.3]
C50  value 1uF  [RAD-0.3]
JP2  (no value)  [HDR1X3]
PF1  (no value)  [PIN-W2/E2.8]
Q16  BDX34B  [SOT-23B_N]
R82  value 20k  [AXIAL-0.3]
R83  value 29k4  [AXIAL-0.3]
R84  value 330R  [AXIAL-0.3]
R85  value 10k  [AXIAL-0.3]
R86  value 10k  [AXIAL-0.3]
R87  value 604R  [AXIAL-0.3]
R88  value 10k  [AXIAL-0.3]
U8  LM2937ET-5.0  [TS3B_N]
U9  LM2941CT  [TS5B_N]
U10  TL-431ACLP
U11  MCP1700-3302E/TO  [SOT-23-NB3_M]

### Ports
+5V TPS (out), PA5 (in)

### Nets
ECU GND: C43.1 C44.1 C45.1 C46.1 C47.1 C48.1 C49.1 C50.1 Q16.2(C) R86.1 R88.1 U8.2(GND) U8.4(TAB) U9.3(GND) U9.6(TAB) U10.2(A) U11.1 ; off-sheet ECU GND  [project net SENSOR GND]
+3.3V SD CARD: C50.2 U11.3(Vout) ; off-sheet +3.3V SD CARD
+5V MICRO: C43.2 C44.2 C49.2 R82.2 U8.3(OUT) U11.2(Vin) ; off-sheet +5V MICRO
+5V SWITCHED: C48.2 PF1.1 Q16.3(E) R83.2 R84.2 R85.2 U9.5(OUT) ; off-sheet +5V SWITCHED
+5V TPS: PF1.2 ; port +5V TPS
+12V CONSTANT: JP2.1 ; off-sheet +12V CONSTANT
+12V ECCS: JP2.3 ; off-sheet +12V ECCS
PA5: R82.1 U9.2(ON/OFF) ; port PA5
NetC45_2: C45.2 C46.2 C47.2 JP2.2 U8.1(IN) U9.4(IN)
NetQ16_1: Q16.1(B) R84.1 U10.3(K)
NetR83_1: R83.1 R86.2 U9.1(ADJ)
NetR85_1: R85.1 R87.2
NetR87_1: R87.1 R88.2 U10.1(REF)

### Notes on the sheet
- 10V+
- (near C44) 10V+
- (near C45) 35V+
- (near C46) 35V+
- (near C47) 35V+
- (near C48) 10V+
- NOTE: 20k pullup resistor is due to LM2941S input pin max current limit.
- NOTE: Resistors R?, R?, R?, R? and R? must be 0.1% tolerance or greater.
- (near C49) 10V+
- (near C50) 10V+
- Title
- Size:
- Date:
- A4
- Number:
- Time:
- Revision:
- Sheet
- of
- (in symbol Volt Reg) GND

### Library data of the parts
C43-C50 = Cap: Capacitor; Published: 8-Jun-2000; LatestRevisionDate: 17-Jul-2002; LatestRevisionNote: Re-released for DXP Platform.; PackageReference: RAD-0.3; Publisher: Altium Limited; PackageDescription: Radial Cap, Thru-Hole; 2 Leads; 0.3 in Pin Spacing
JP2 = Header 3: Header, 3-Pin; LatestRevisionDate: 17-Jul-2002; LatestRevisionNote: Re-released for DXP Platform.; Publisher: Altium Limited
PF1 = Fuse 2: Fuse; Published: 8-Jun-2000; LatestRevisionDate: 17-Jul-2002; LatestRevisionNote: Re-released for DXP Platform.; PackageReference: PIN-W2/E2.8; Publisher: Altium Limited; PackageDescription: Thru-Hole; 2 Leads
Q16 = PNP: PNP Bipolar Transistor; Published: 8-Jun-2000; LatestRevisionDate: 29-May-2009; LatestRevisionNote: IPC-7351 Footprint Added.; PackageVersion: Aug-1999; PackageReference: SOT-23B; Publisher: Altium Limited; PackageDescription: 3-Pin SOT-23 Package 0.95 mm Pitch, 2.4 mm Lead Span
R82-R88 = Res1: Resistor; Published: 8-Jun-2000; LatestRevisionDate: 17-Jul-2002; LatestRevisionNote: Re-released for DXP Platform.; PackageReference: AXIAL-0.3; Publisher: Altium Limited; PackageDescription: Axial Device, Thru-Hole; 2 Leads; 0.3 in Pin Spacing
U8 = LM2937ES-5.0: 500 mA Low Dropout Regulator, 3-pin TO-263; Manufacturer: National Semiconductor; PackageTopMarking: NSUZXYTTE#*LM2937ES*-5.0; PowerWise: N; CompType: LDO IC; Published: 4-Dec-2008; DatasheetVersion: Aug-2005; PackageVersion: revF, Apr-2005; PackageReference: TS3B; Publisher: Altium Limited; PackageDescription: TO-263, Molded, .400 x .390 x .180in, 3 Lead, .1in Pitch, Surface Mount; PartNumber: LM2937ES-5.0; RoHS: N; PinCount: 3; Code_JEDEC: MO-169-AA; ComponentLink1Description: LM2937 Datasheet; ComponentLink1URL: http://www.national.com/ds/LM/LM2937.pdf; ComponentLink2Description: LM2937 Web Page; ComponentLink2URL: http://www.national.com/pf/LM/LM2937.html; ComponentLink3Description: TS3B Package Page; ComponentLink3URL: http://www.national.com/packaging/folders/ts3b.html
U9 = LM2941S: 1A Low Dropout Adjustable Regulator, 5-pin TO-263; Manufacturer: National Semiconductor; PackageTopMarking: NSUZXYTTE#*LM2941S*P+; PowerWise: N; CompType: LDO IC; Published: 4-Dec-2008; DatasheetVersion: Nov-2007; PackageVersion: revD, Apr-2005; PackageReference: TS5B; Publisher: Altium Limited; PackageDescription: TO-263, Molded, .400 x .390 x .180in, 5 Lead, .067in Pitch, Surface Mount; Supplier 1: Farnell; Supplier Part Number 1: 9494456; PartNumber: LM2941S; RoHS: N; PinCount: 5; Code_JEDEC: MO-169-AB; ComponentLink1Description: LM2941 Datasheet; ComponentLink1URL: http://www.national.com/ds/LM/LM2941.pdf; ComponentLink2Description: LM2941 Web Page; ComponentLink2URL: http://www.national.com/pf/LM/LM2941.html; ComponentLink3Description: TS5B Package Page; ComponentLink3URL: http://www.national.com/packaging/folders/ts5b.html
U10 = PM-REF-431-SIL3
U11 = Volt Reg: Voltage Regulator; Published: 24-Mar-1999; LatestRevisionDate: 29-May-2009; LatestRevisionNote: IPC-7351 Footprint Added.; PackageReference: D2PAK; Publisher: Altium Limited; PackageDescription: 3-Pin Transistor Outline Package 2.54 mm Pitch, 15.1 mm Lead Span

## Sheet CAS Interface.SchDoc: RB25DET - CAS Interface
size A4; Address1: Drawn By:; Address2: Dan Visser; DocumentNumber: A; Revision: 0.1; SheetNumber: 7; SheetTotal: 12
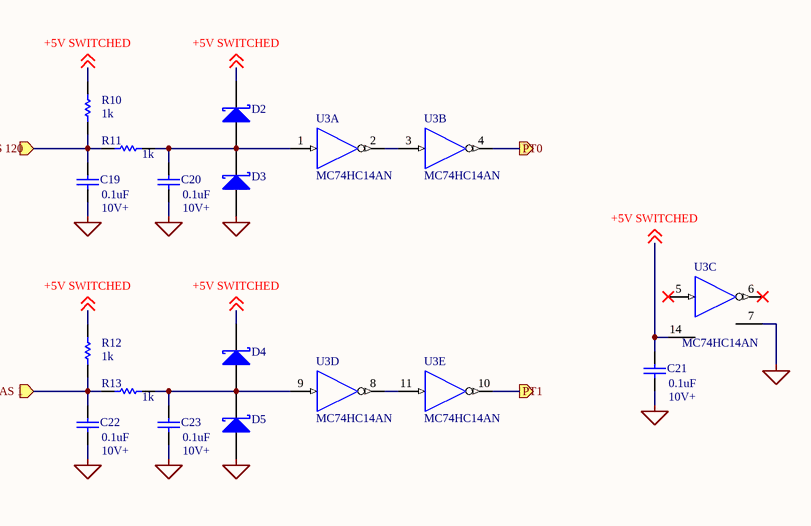
[diagram p6: CAS Interface.SchDoc]

### Parts
C19  value 0.1uF  [RAD-0.3]
C20  value 0.1uF  [RAD-0.3]
C21  value 0.1uF  [RAD-0.3]
C22  value 0.1uF  [RAD-0.3]
C23  value 0.1uF  [RAD-0.3]
D2  (no value)  [SMB]
D3  (no value)  [SMB]
D4  (no value)  [SMB]
D5  (no value)  [SMB]
R10  value 1k  [AXIAL-0.3]
R11  value 1k  [AXIAL-0.3]
R12  value 1k  [AXIAL-0.3]
R13  value 1k  [AXIAL-0.3]
U3  MC74HC14AN  [646-06]  (parts A,B,C,D,E of 6)

### Ports
CAS 1 (in), CAS 120 (in), PT0 (out), PT1 (out)

### Nets
GND: U3.7(GND)
SENSOR GND: C19.1 C20.1 C21.1 C22.1 C23.1 D3.1(A) D5.1(A) U3.7(GND)
VDD: U3.14(VDD)
+5V SWITCHED: C21.2 D2.2(K) D4.2(K) R10.1 R12.1 U3.14(VDD) ; off-sheet +5V SWITCHED
CAS 1: C22.2 R12.2 R13.1 ; port CAS 1
CAS 120: C19.2 R10.2 R11.1 ; port CAS 120
PT0: U3.4(Y) ; port PT0
PT1: U3.10(Y) ; port PT1
NetC20_2: C20.2 D2.1(A) D3.2(K) R11.2 U3.1(A)
NetC23_2: C23.2 D4.1(A) D5.2(K) R13.2 U3.9(A)
NetU3_2: U3.2(Y) U3.3(A)
NetU3_8: U3.8(Y) U3.11(A)

Not connected (* = marked no-connect by the designer): U3 5(A)* 6(Y)*

### Notes on the sheet
- (near C19) 10V+
- 10V+
- (near C21) 10V+
- (near C22) 10V+
- Title
- Size:
- Date:
- A4
- Number:
- Time:
- Revision:
- Sheet
- of

### Library data of the parts
C19-C23 = Cap: Capacitor; Published: 8-Jun-2000; LatestRevisionDate: 17-Jul-2002; LatestRevisionNote: Re-released for DXP Platform.; PackageReference: RAD-0.3; Publisher: Altium Limited; PackageDescription: Radial Cap, Thru-Hole; 2 Leads; 0.3 in Pin Spacing
D2-D5 = D Schottky: Schottky Diode; Published: 8-Jun-2000; LatestRevisionDate: 17-Jul-2002; LatestRevisionNote: Re-released for DXP Platform.; PackageReference: SMB; Publisher: Altium Limited; PackageDescription: DO-214-AA/SMB; 2 C-Bend Leads; Body 5.3 x 3.6 mm, inc. leads (LxW); Code_JEDEC: DO-214-AA
R10-R13 = Res1: Resistor; Published: 8-Jun-2000; LatestRevisionDate: 17-Jul-2002; LatestRevisionNote: Re-released for DXP Platform.; PackageReference: AXIAL-0.3; Publisher: Altium Limited; PackageDescription: Axial Device, Thru-Hole; 2 Leads; 0.3 in Pin Spacing
U3 = MC74HC14AN: Hex Schmitt Trigger Inverter; Published: 17-Jul-2002; LatestRevisionDate: 06-Jun-2005; LatestRevisionNote: Stylized 3D Model Added; DatasheetVersion: 1989; PackageVersion: 1997; PackageReference: 646-06; Publisher: Altium Limited; PackageDescription: DIP; 14 Leads; Row Spacing 7.62 mm; Pitch 2.54 mm; ComponentLink1Description: Manufacturer Link; ComponentLink1URL: http://www.onsemi.com/site/products/parametrics/0,4446,247,00.html; ComponentLink2Description: Ibis Model; ComponentLink2URL: http://www.onsemi.com/pub/Collateral/MC54HC14AJ.IBS

## Sheet Connector.SchDoc: RB25DET - Connector
size A4; Address1: Drawn By:; Address2: Dan Visser; DocumentNumber: A; Revision: 0.1; SheetNumber: 12; SheetTotal: 12
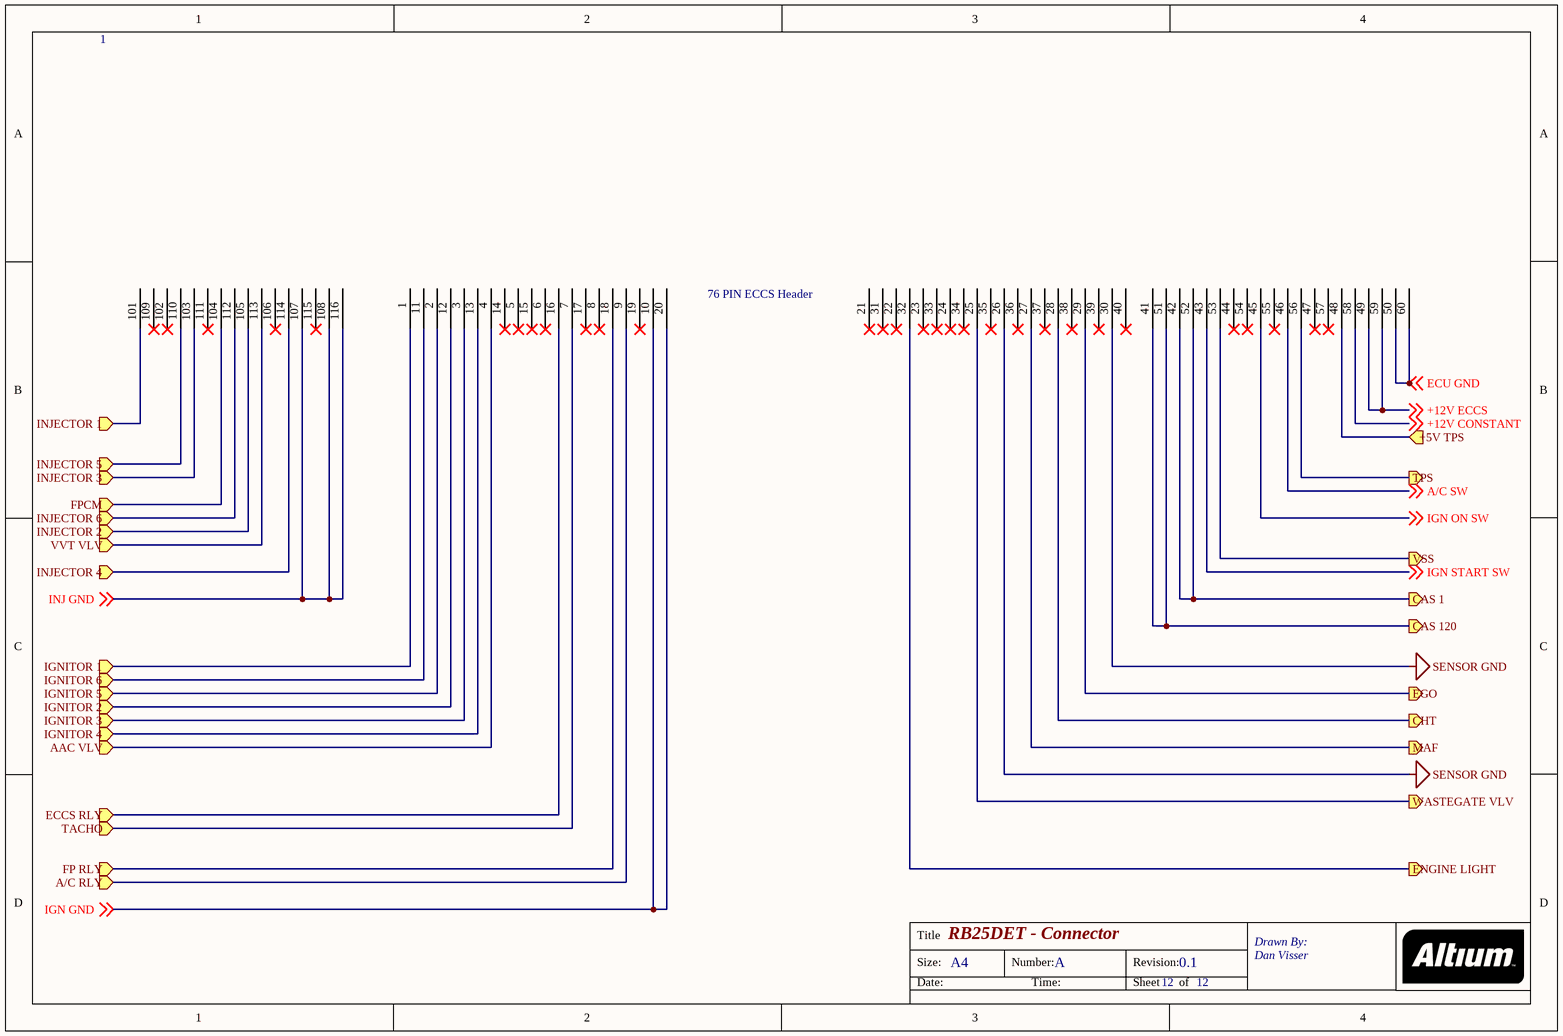
[diagram p7: Connector.SchDoc]

### Parts
1  76 PIN ECCS Header

### Ports
+5V TPS (in), A/C RLY (in), AAC VLV (in), CAS 1 (out), CAS 120 (out), CHT (out), ECCS RLY (in), EGO (out), ENGINE LIGHT (out), FP RLY (in), FPCM (in), IGNITOR 1 (in), IGNITOR 2 (in), IGNITOR 3 (in), IGNITOR 4 (in), IGNITOR 5 (in), IGNITOR 6 (in), INJECTOR 1 (in), INJECTOR 2 (in), INJECTOR 3 (in), INJECTOR 4 (in), INJECTOR 5 (in), INJECTOR 6 (in), MAF (out), TACHO (in), TPS (out), VSS (out), VVT VLV (in), WASTEGATE VLV (out)

### Nets
SENSOR GND: 1.26 1.30
+5V TPS: 1.48 ; port +5V TPS
+12V CONSTANT: 1.58 ; off-sheet +12V CONSTANT
+12V ECCS: 1.49 1.59 ; off-sheet +12V ECCS
A/C RLY: 1.9 ; port A/C RLY
A/C SW: 1.46 ; off-sheet A/C SW
AAC VLV: 1.4 ; port AAC VLV
AN01: 1.28 ; port CHT
AN02: 1.56 ; port TPS
AN03: 1.29 ; port EGO
AN08: 1.27 ; port MAF
CAS 1: 1.42 1.52 ; port CAS 1
CAS 120: 1.41 1.51 ; port CAS 120
ECCS RLY: 1.16 ; port ECCS RLY
ECU GND: 1.50 1.60 ; off-sheet ECU GND
ENGINE LIGHT: 1.32 ; port ENGINE LIGHT
FPCM: 1.104 ; port FPCM
IGN GND: 1.10 1.20 ; off-sheet IGN GND
IGN ON SW: 1.45 ; off-sheet IGN ON SW
IGN START SW: 1.43 ; off-sheet IGN START SW
IGNITOR 1: 1.1 ; port IGNITOR 1
IGNITOR 2: 1.12 ; port IGNITOR 2
IGNITOR 3: 1.3 ; port IGNITOR 3
IGNITOR 4: 1.13 ; port IGNITOR 4
IGNITOR 5: 1.2 ; port IGNITOR 5
IGNITOR 6: 1.11 ; port IGNITOR 6
INJ GND: 1.107 1.108 1.116 ; off-sheet INJ GND
INJECTOR 1: 1.101 ; port INJECTOR 1
INJECTOR 2: 1.105 ; port INJECTOR 2
INJECTOR 3: 1.103 ; port INJECTOR 3
INJECTOR 4: 1.114 ; port INJECTOR 4
INJECTOR 5: 1.110 ; port INJECTOR 5
INJECTOR 6: 1.112 ; port INJECTOR 6
TACHO: 1.7 ; port TACHO
VSS: 1.53 ; port VSS
VVT VLV: 1.113 ; port VVT VLV
WASTEGATE VLV: 1.25 ; port WASTEGATE VLV
Net1_18: 1.18 ; port FP RLY

Not connected (* = marked no-connect by the designer): 1 5* 6* 8* 14* 15* 17* 19* 21* 22* 23* 24* 31* 33* 34* 35* 36* 37* 38* 39* 40* 44* 47* 54* 55* 57* 102* 106* 109* 111* 115*

### Notes on the sheet
- Title
- Size:
- Date:
- A4
- Number:
- Time:
- Revision:
- Sheet
- of

## Sheet Core Analogue Inputs.SchDoc: RB25DET - Core Analogue Inputs
size A4; Address1: Drawn By:; Address2: Dan Visser; DocumentNumber: A; Revision: 0.1; SheetNumber: 4; SheetTotal: 12
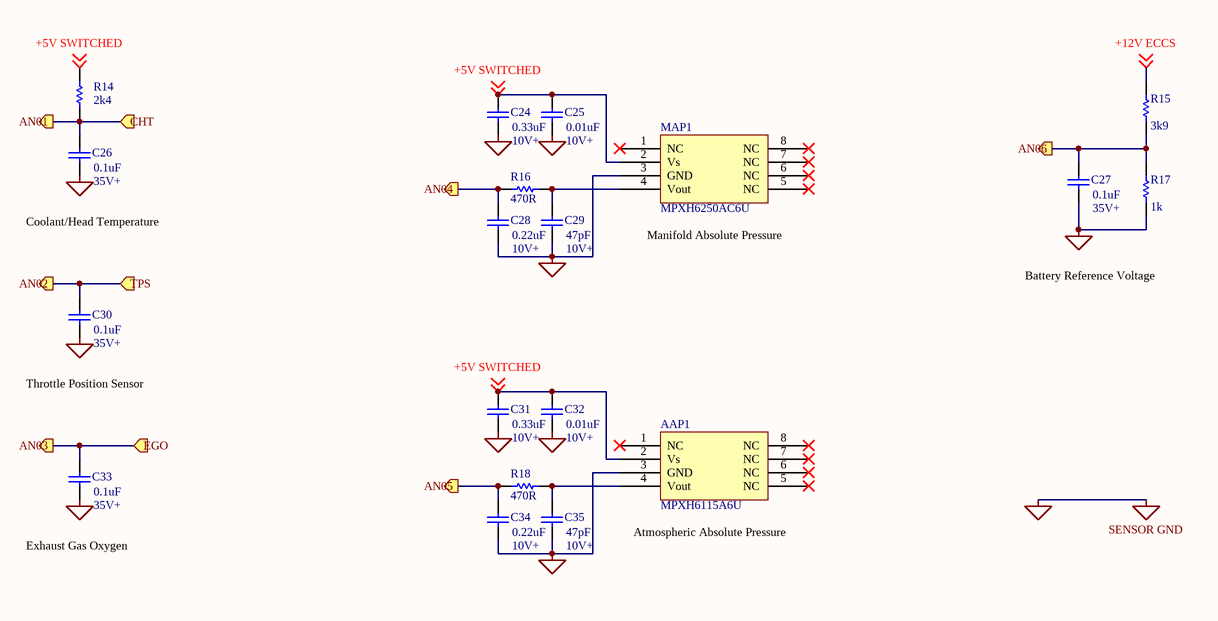
[diagram p8: Core Analogue Inputs.SchDoc]

### Parts
AAP1  MPXH6115A6U
C24  value 0.33uF  [RAD-0.3]
C25  value 0.01uF  [RAD-0.3]
C26  value 0.1uF  [RAD-0.3]
C27  value 0.1uF  [RAD-0.3]
C28  value 0.22uF  [RAD-0.3]
C29  value 47pF  [RAD-0.3]
C30  value 0.1uF  [RAD-0.3]
C31  value 0.33uF  [RAD-0.3]
C32  value 0.01uF  [RAD-0.3]
C33  value 0.1uF  [RAD-0.3]
C34  value 0.22uF  [RAD-0.3]
C35  value 47pF  [RAD-0.3]
MAP1  MPXH6250AC6U
R14  value 2k4  [AXIAL-0.3]
R15  value 3k9  [AXIAL-0.3]
R16  value 470R  [AXIAL-0.3]
R17  value 1k  [AXIAL-0.3]
R18  value 470R  [AXIAL-0.3]

### Ports
AN01 (out), AN02 (out), AN03 (out), AN04 (out), AN05 (out), AN06 (out), CHT (in), EGO (in), TPS (in)

### Nets
SENSOR GND: AAP1.3(GND) C24.1 C25.1 C26.1 C27.1 C28.1 C29.1 C30.1 C31.1 C32.1 C33.1 C34.1 C35.1 MAP1.3(GND) R17.1
+5V SWITCHED: AAP1.2(Vs) C24.2 C25.2 C31.2 C32.2 MAP1.2(Vs) R14.1 ; off-sheet +5V SWITCHED
+12V ECCS: R15.2 ; off-sheet +12V ECCS
AN01: C26.2 R14.2 ; port AN01, port CHT
AN02: C30.2 ; port AN02, port TPS
AN03: C33.2 ; port AN03, port EGO
AN04: C28.2 R16.1 ; port AN04
AN05: C34.2 R18.1 ; port AN05
AN06: C27.2 R15.1 R17.2 ; port AN06
NetAAP1_4: AAP1.4(Vout) C35.2 R18.2
NetC29_2: C29.2 MAP1.4(Vout) R16.2

Not connected (* = marked no-connect by the designer): AAP1 1(NC)* 5(NC)* 6(NC)* 7(NC)* 8(NC)*; MAP1 1(NC)* 5(NC)* 6(NC)* 7(NC)* 8(NC)*

### Notes on the sheet
- 10V+
- (near C25) 10V+
- Coolant/Head Temperature
- (near C26) 35V+
- (near MAP1) Manifold Absolute Pressure
- 35V+
- (near C29) 10V+
- Battery Reference Voltage
- (near C30) 35V+
- Throttle Position Sensor
- (near C32) 10V+
- (near C33) 35V+
- Exhaust Gas Oxygen
- (near C35) 10V+
- (near AAP1) Atmospheric Absolute Pressure
- Title
- Size:
- Date:
- A4
- Number:
- Time:
- Revision:
- Sheet
- of

### Library data of the parts
AAP1 = MPXH6115A6T1
C24-C35 = Cap: Capacitor; Published: 8-Jun-2000; LatestRevisionDate: 17-Jul-2002; LatestRevisionNote: Re-released for DXP Platform.; PackageReference: RAD-0.3; Publisher: Altium Limited; PackageDescription: Radial Cap, Thru-Hole; 2 Leads; 0.3 in Pin Spacing
R14-R18 = Res1: Resistor; Published: 8-Jun-2000; LatestRevisionDate: 17-Jul-2002; LatestRevisionNote: Re-released for DXP Platform.; PackageReference: AXIAL-0.3; Publisher: Altium Limited; PackageDescription: Axial Device, Thru-Hole; 2 Leads; 0.3 in Pin Spacing

## Sheet Extra Analogue Inputs.SchDoc: RB25DET - Extra Analogue Inputs
size A4; Address1: Drawn By:; Address2: Dan Visser; DocumentNumber: A; Revision: 0.1; SheetNumber: 5; SheetTotal: 12
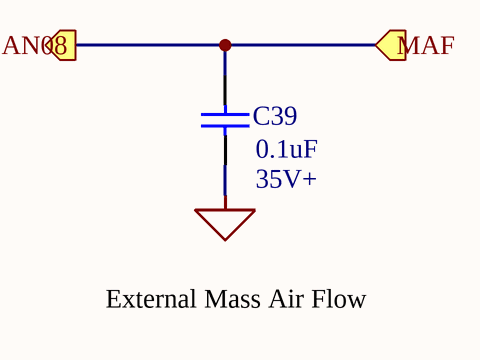
[diagram p9: Extra Analogue Inputs.SchDoc]

### Parts
C39  value 0.1uF  [RAD-0.3]

### Ports
AN08 (out), MAF (in)

### Nets
SENSOR GND: C39.1
AN08: C39.2 ; port AN08, port MAF

### Notes on the sheet
- (near C39) 35V+
- External Mass Air Flow
- Title
- Size:
- Date:
- A4
- Number:
- Time:
- Revision:
- Sheet
- of

### Library data of the parts
C39 = Cap: Capacitor; Published: 8-Jun-2000; LatestRevisionDate: 17-Jul-2002; LatestRevisionNote: Re-released for DXP Platform.; PackageReference: RAD-0.3; Publisher: Altium Limited; PackageDescription: Radial Cap, Thru-Hole; 2 Leads; 0.3 in Pin Spacing

## Sheet Low Side Drivers.SchDoc: RB25DET - Low Side Drivers
size A4; Address1: Drawn By:; Address2: Dan Visser; DocumentNumber: A; Revision: 0.1; SheetNumber: 10; SheetTotal: 12
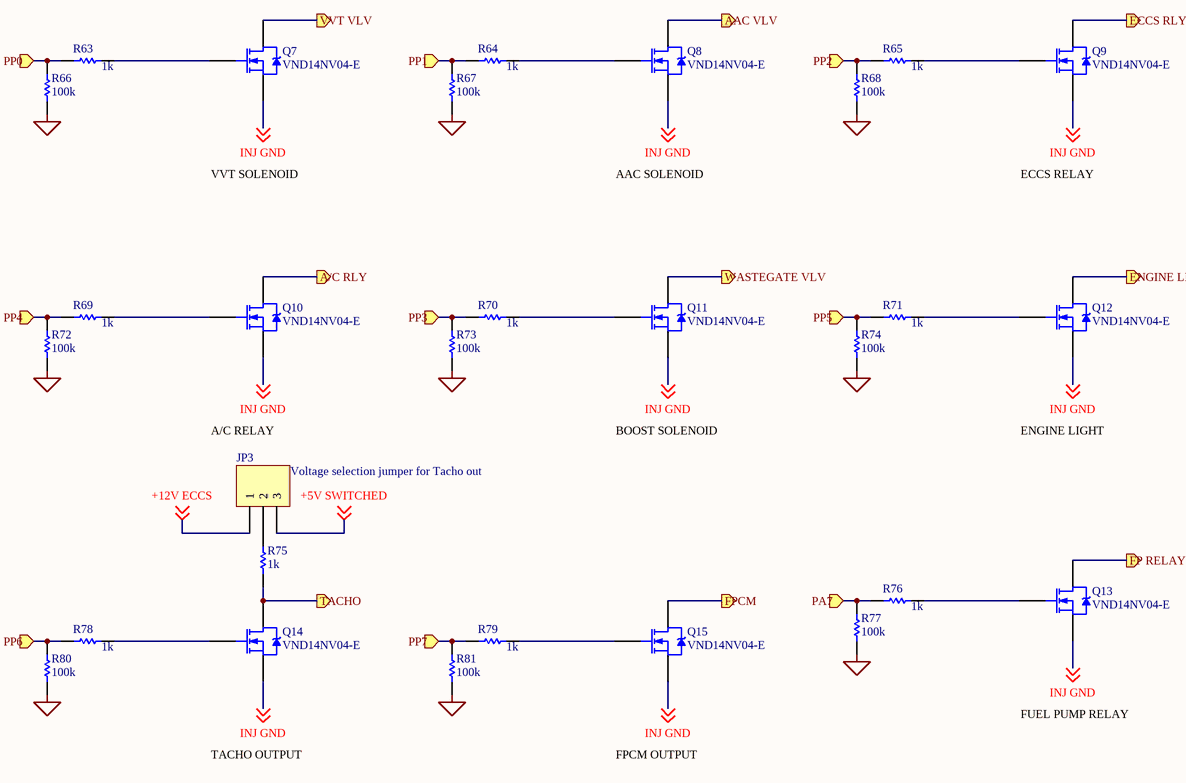
[diagram p10: Low Side Drivers.SchDoc]

### Parts
JP3  Voltage selection jumper for Tacho out  [HDR1X3]
Q7  VND14NV04-E  [TO-220AB]
Q8  VND14NV04-E  [TO-220AB]
Q9  VND14NV04-E  [TO-220AB]
Q10  VND14NV04-E  [TO-220AB]
Q11  VND14NV04-E  [TO-220AB]
Q12  VND14NV04-E  [TO-220AB]
Q13  VND14NV04-E  [TO-220AB]
Q14  VND14NV04-E  [TO-220AB]
Q15  VND14NV04-E  [TO-220AB]
R63  value 1k  [AXIAL-0.3]
R64  value 1k  [AXIAL-0.3]
R65  value 1k  [AXIAL-0.3]
R66  value 100k  [AXIAL-0.3]
R67  value 100k  [AXIAL-0.3]
R68  value 100k  [AXIAL-0.3]
R69  value 1k  [AXIAL-0.3]
R70  value 1k  [AXIAL-0.3]
R71  value 1k  [AXIAL-0.3]
R72  value 100k  [AXIAL-0.3]
R73  value 100k  [AXIAL-0.3]
R74  value 100k  [AXIAL-0.3]
R75  value 1k  [AXIAL-0.3]
R76  value 1k  [AXIAL-0.3]
R77  value 100k  [AXIAL-0.3]
R78  value 1k  [AXIAL-0.3]
R79  value 1k  [AXIAL-0.3]
R80  value 100k  [AXIAL-0.3]
R81  value 100k  [AXIAL-0.3]

### Ports
A/C RLY (out), AAC VLV (out), ECCS RLY (out), ENGINE LIGHT (out), FP RELAY (out), FPCM (out), PA7 (in), PP0 (in), PP1 (in), PP2 (in), PP3 (in), PP4 (in), PP5 (in), PP6 (in), PP7 (in), TACHO (out), VVT VLV (out), WASTEGATE VLV (out)

### Nets
SENSOR GND: R66.1 R67.1 R68.1 R72.1 R73.1 R74.1 R77.1 R80.1 R81.1
+5V SWITCHED: JP3.3 ; off-sheet +5V SWITCHED
+12V ECCS: JP3.1 ; off-sheet +12V ECCS
A/C RLY: Q10.2(D) ; port A/C RLY
AAC VLV: Q8.2(D) ; port AAC VLV
ECCS RLY: Q9.2(D) ; port ECCS RLY
ENGINE LIGHT: Q12.2(D) ; port ENGINE LIGHT
FP RELAY: Q13.2(D) ; port FP RELAY
FPCM: Q15.2(D) ; port FPCM
INJ GND: Q7.3(S) Q8.3(S) Q9.3(S) Q10.3(S) Q11.3(S) Q12.3(S) Q13.3(S) Q14.3(S) Q15.3(S) ; off-sheet INJ GND
PA7: R76.1 R77.2 ; port PA7
PP0: R63.1 R66.2 ; port PP0
PP1: R64.1 R67.2 ; port PP1
PP2: R65.1 R68.2 ; port PP2
PP3: R70.1 R73.2 ; port PP3
PP4: R69.1 R72.2 ; port PP4
PP5: R71.1 R74.2 ; port PP5
PP6: R78.1 R80.2 ; port PP6
PP7: R79.1 R81.2 ; port PP7
TACHO: Q14.2(D) R75.1 ; port TACHO
VVT VLV: Q7.2(D) ; port VVT VLV
WASTEGATE VLV: Q11.2(D) ; port WASTEGATE VLV
NetJP3_2: JP3.2 R75.2
NetQ7_1: Q7.1(G) R63.2
NetQ8_1: Q8.1(G) R64.2
NetQ9_1: Q9.1(G) R65.2
NetQ10_1: Q10.1(G) R69.2
NetQ11_1: Q11.1(G) R70.2
NetQ12_1: Q12.1(G) R71.2
NetQ13_1: Q13.1(G) R76.2
NetQ14_1: Q14.1(G) R78.2
NetQ15_1: Q15.1(G) R79.2

### Notes on the sheet
- VVT SOLENOID
- AAC SOLENOID
- ECCS RELAY
- A/C RELAY
- BOOST SOLENOID
- ENGINE LIGHT
- FUEL PUMP RELAY
- TACHO OUTPUT
- FPCM OUTPUT
- Title
- Size:
- Date:
- A4
- Number:
- Time:
- Revision:
- Sheet
- of

### Library data of the parts
JP3 = Header 3: Header, 3-Pin; LatestRevisionDate: 17-Jul-2002; LatestRevisionNote: Re-released for DXP Platform.; Publisher: Altium Limited
Q7-Q15 = IRL520N: as Q1 on sheet Injectors; Published: 8-Jun-2000; LatestRevisionDate: 17-Jul-2002; LatestRevisionNote: Re-released for DXP Platform.; DatasheetVersion: May-1998; PackageVersion: Feb-1997; PackageReference: TO-220AB; Publisher: Altium Limited; PackageDescription: TO, Thru-Hole, Vertical, Heatsink Mounted; 3 In-Line Leads; Pitch 2.54 mm; ComponentLink1Description: Manufacturer Link; ComponentLink1URL: http://www.irf.com/; ComponentLink2Description: Datasheet; ComponentLink2URL: http://www.irf.com/product-info/datasheets/data/irl520n.pdf
R63-R81 = Res1: Resistor; Published: 8-Jun-2000; LatestRevisionDate: 17-Jul-2002; LatestRevisionNote: Re-released for DXP Platform.; PackageReference: AXIAL-0.3; Publisher: Altium Limited; PackageDescription: Axial Device, Thru-Hole; 2 Leads; 0.3 in Pin Spacing

## Sheet SD Card Interface.SchDoc: RB25DET - SD Card Interface
size A4; Address1: Drawn By:; Address2: Dan Visser; DocumentNumber: A; Revision: 0.1; SheetNumber: 11; SheetTotal: 12
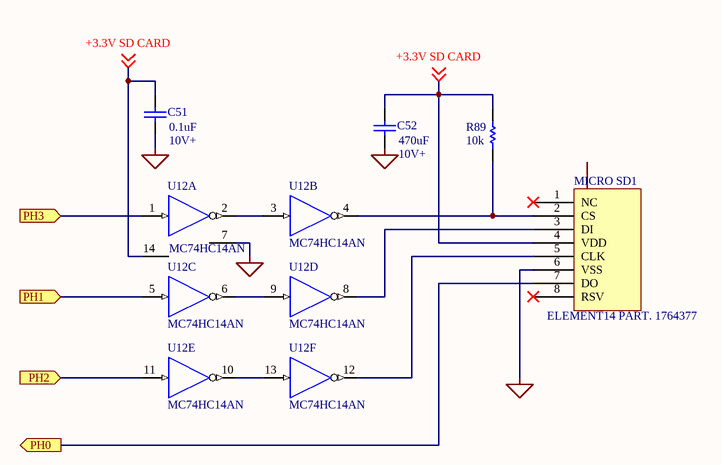
[diagram p11: SD Card Interface.SchDoc]

### Parts
C51  value 0.1uF  [RAD-0.3]
C52  value 470uF  [RAD-0.3]
MICRO_SD1  ELEMENT14 PART. 1764377
R89  value 10k  [AXIAL-0.3]
U12  MC74HC14AN  [646-06]  (parts A,B,C,D,E,F of 6)

### Ports
PH0 (out), PH1 (in), PH2 (in), PH3 (in)

### Nets
GND: U12.7(GND)
SENSOR GND: C51.1 C52.1 MICRO_SD1.6(VSS) U12.7(GND)
VDD: U12.14(VDD)
+3.3V SD CARD: C51.2 C52.2 MICRO_SD1.4(VDD) R89.2 U12.14(VDD) ; off-sheet +3.3V SD CARD
PH0: MICRO_SD1.7(DO) ; port PH0
PH1: U12.5(A) ; port PH1
PH2: U12.11(A) ; port PH2
PH3: U12.1(A) ; port PH3
NetMICRO_SD1_2: MICRO_SD1.2(CS) R89.1 U12.4(Y)
NetMICRO_SD1_3: MICRO_SD1.3(DI) U12.8(Y)
NetMICRO_SD1_5: MICRO_SD1.5(CLK) U12.12(Y)
NetU12_2: U12.2(Y) U12.3(A)
NetU12_6: U12.6(Y) U12.9(A)
NetU12_10: U12.10(Y) U12.13(A)

Not connected (* = marked no-connect by the designer): MICRO_SD1 1(NC)* 8(RSV)*

### Notes on the sheet
- (near C51) 10V+
- (near C52) 10V+
- Title
- Size:
- Date:
- A4
- Number:
- Time:
- Revision:
- Sheet
- of

### Library data of the parts
C51 C52 = Cap: Capacitor; Published: 8-Jun-2000; LatestRevisionDate: 17-Jul-2002; LatestRevisionNote: Re-released for DXP Platform.; PackageReference: RAD-0.3; Publisher: Altium Limited; PackageDescription: Radial Cap, Thru-Hole; 2 Leads; 0.3 in Pin Spacing
R89 = Res1: Resistor; Published: 8-Jun-2000; LatestRevisionDate: 17-Jul-2002; LatestRevisionNote: Re-released for DXP Platform.; PackageReference: AXIAL-0.3; Publisher: Altium Limited; PackageDescription: Axial Device, Thru-Hole; 2 Leads; 0.3 in Pin Spacing
U12 = MC74HC14AN: Hex Schmitt Trigger Inverter; Published: 17-Jul-2002; LatestRevisionDate: 06-Jun-2005; LatestRevisionNote: Stylized 3D Model Added; DatasheetVersion: 1989; PackageVersion: 1997; PackageReference: 646-06; Publisher: Altium Limited; PackageDescription: DIP; 14 Leads; Row Spacing 7.62 mm; Pitch 2.54 mm; ComponentLink1Description: Manufacturer Link; ComponentLink1URL: http://www.onsemi.com/site/products/parametrics/0,4446,247,00.html; ComponentLink2Description: Ibis Model; ComponentLink2URL: http://www.onsemi.com/pub/Collateral/MC54HC14AJ.IBS

## Nets that join several sheets
GND: Digital Inputs (U3.7), CAS Interface (U3.7), SD Card Interface (U12.7)
SENSOR GND: CPU (31 pins), Ignitor Outputs (9 pins), Injectors (6 pins), Digital Inputs (9 pins), USB Comms (U14.4), Power Supplies (17 pins), CAS Interface (8 pins), Connector (1.26 1.30), Core Analogue Inputs (15 pins), Extra Analogue Inputs (C39.1), Low Side Drivers (9 pins), SD Card Interface (C51.1 C52.1 MICRO_SD1.6 U12.7)
VDD: Digital Inputs (U3.14), CAS Interface (U3.14), SD Card Interface (U12.14)
+5V TPS: Power Supplies (PF1.2), Connector (1.48)
A/C RLY: Connector (1.9), Low Side Drivers (Q10.2)
AAC VLV: Connector (1.4), Low Side Drivers (Q8.2)
AN01: CPU (U1.91), Connector (1.28), Core Analogue Inputs (C26.2 R14.2)
AN02: CPU (U1.93), Connector (1.56), Core Analogue Inputs (C30.2)
AN03: CPU (U1.95), Connector (1.29), Core Analogue Inputs (C33.2)
AN04: CPU (U1.97), Core Analogue Inputs (C28.2 R16.1)
AN05: CPU (U1.99), Core Analogue Inputs (C34.2 R18.1)
AN06: CPU (U1.101), Core Analogue Inputs (C27.2 R15.1 R17.2)
AN08: CPU (U1.90), Connector (1.27), Extra Analogue Inputs (C39.2)
AN17: CPU (U1.106), Digital Inputs (R21.2 U4.4 U4.7)
CAS 1: CAS Interface (C22.2 R12.2 R13.1), Connector (1.42 1.52)
CAS 120: CAS Interface (C19.2 R10.2 R11.1), Connector (1.41 1.51)
CPU RXD0: CPU (U1.119), USB Comms (U14.2)
CPU TXD0: CPU (U1.120), USB Comms (U14.3)
ECCS RLY: Connector (1.16), Low Side Drivers (Q9.2)
ENGINE LIGHT: Connector (1.32), Low Side Drivers (Q12.2)
FPCM: Connector (1.104), Low Side Drivers (Q15.2)
IGNITOR 1: Ignitor Outputs (R29.2), Connector (1.1)
IGNITOR 2: Ignitor Outputs (R30.2), Connector (1.12)
IGNITOR 3: Ignitor Outputs (R35.2), Connector (1.3)
IGNITOR 4: Ignitor Outputs (R36.2), Connector (1.13)
IGNITOR 5: Ignitor Outputs (R41.2), Connector (1.2)
IGNITOR 6: Ignitor Outputs (R42.2), Connector (1.11)
INJECTOR 1: Injectors (Q1.2), Connector (1.101)
INJECTOR 2: Injectors (Q4.2), Connector (1.105)
INJECTOR 3: Injectors (Q2.2), Connector (1.103)
INJECTOR 4: Injectors (Q6.2), Connector (1.114)
INJECTOR 5: Injectors (Q3.2), Connector (1.110)
INJECTOR 6: Injectors (Q5.2), Connector (1.112)
PA0: CPU (U1.73), Digital Inputs (R22.2)
PA5: CPU (U1.78), Power Supplies (R82.1 U9.2)
PA7: CPU (U1.80), Low Side Drivers (R76.1 R77.2)
PB0: CPU (U1.32), Injectors (R48.1 R51.2)
PB1: CPU (U1.33), Injectors (R57.1 R60.2)
PB2: CPU (U1.34), Injectors (R50.1 R53.2)
PB3: CPU (U1.35), Injectors (R59.1 R62.2)
PB4: CPU (U1.36), Injectors (R49.1 R52.2)
PB5: CPU (U1.37), Injectors (R58.1 R61.2)
PE0: CPU (U1.72), Digital Inputs (R24.2)
PE1: CPU (U1.71), Digital Inputs (R26.2)
PH0: CPU (U1.64), SD Card Interface (MICRO_SD1.7)
PH1: CPU (U1.63), SD Card Interface (U12.5)
PH2: CPU (U1.62), SD Card Interface (U12.11)
PH3: CPU (U1.61), SD Card Interface (U12.1)
PP0: CPU (U1.4), Low Side Drivers (R63.1 R66.2)
PP1: CPU (U1.3), Low Side Drivers (R64.1 R67.2)
PP2: CPU (U1.2), Low Side Drivers (R65.1 R68.2)
PP3: CPU (U1.1), Low Side Drivers (R70.1 R73.2)
PP4: CPU (U1.144), Low Side Drivers (R69.1 R72.2)
PP5: CPU (U1.143), Low Side Drivers (R71.1 R74.2)
PP6: CPU (U1.142), Low Side Drivers (R78.1 R80.2)
PT0: CPU (U1.11), CAS Interface (U3.4)
PT1: CPU (U1.12), CAS Interface (U3.10)
PT2: CPU (U1.13), Ignitor Outputs (R28.2 R31.2), Injectors (R45.1)
PT3: CPU (U1.14), Ignitor Outputs (R27.2 R32.2), Injectors (R54.1)
PT4: CPU (U1.17), Ignitor Outputs (R34.2 R37.2), Injectors (R47.1)
PT5: CPU (U1.18), Ignitor Outputs (R33.2 R38.2), Injectors (R56.1)
PT6: CPU (U1.19), Ignitor Outputs (R40.2 R43.2), Injectors (R46.1)
PT7: CPU (U1.20), Ignitor Outputs (R39.2 R44.2), Injectors (R55.1)
TACHO: Connector (1.7), Low Side Drivers (Q14.2 R75.1)
VSS: Digital Inputs (U4.1), Connector (1.53)
VVT VLV: Connector (1.113), Low Side Drivers (Q7.2)
WASTEGATE VLV: Connector (1.25), Low Side Drivers (Q11.2)